# Altium project EDISON_ARDUINO_HVM_8_26_OLD.PrjPcb (part 1 of 2)
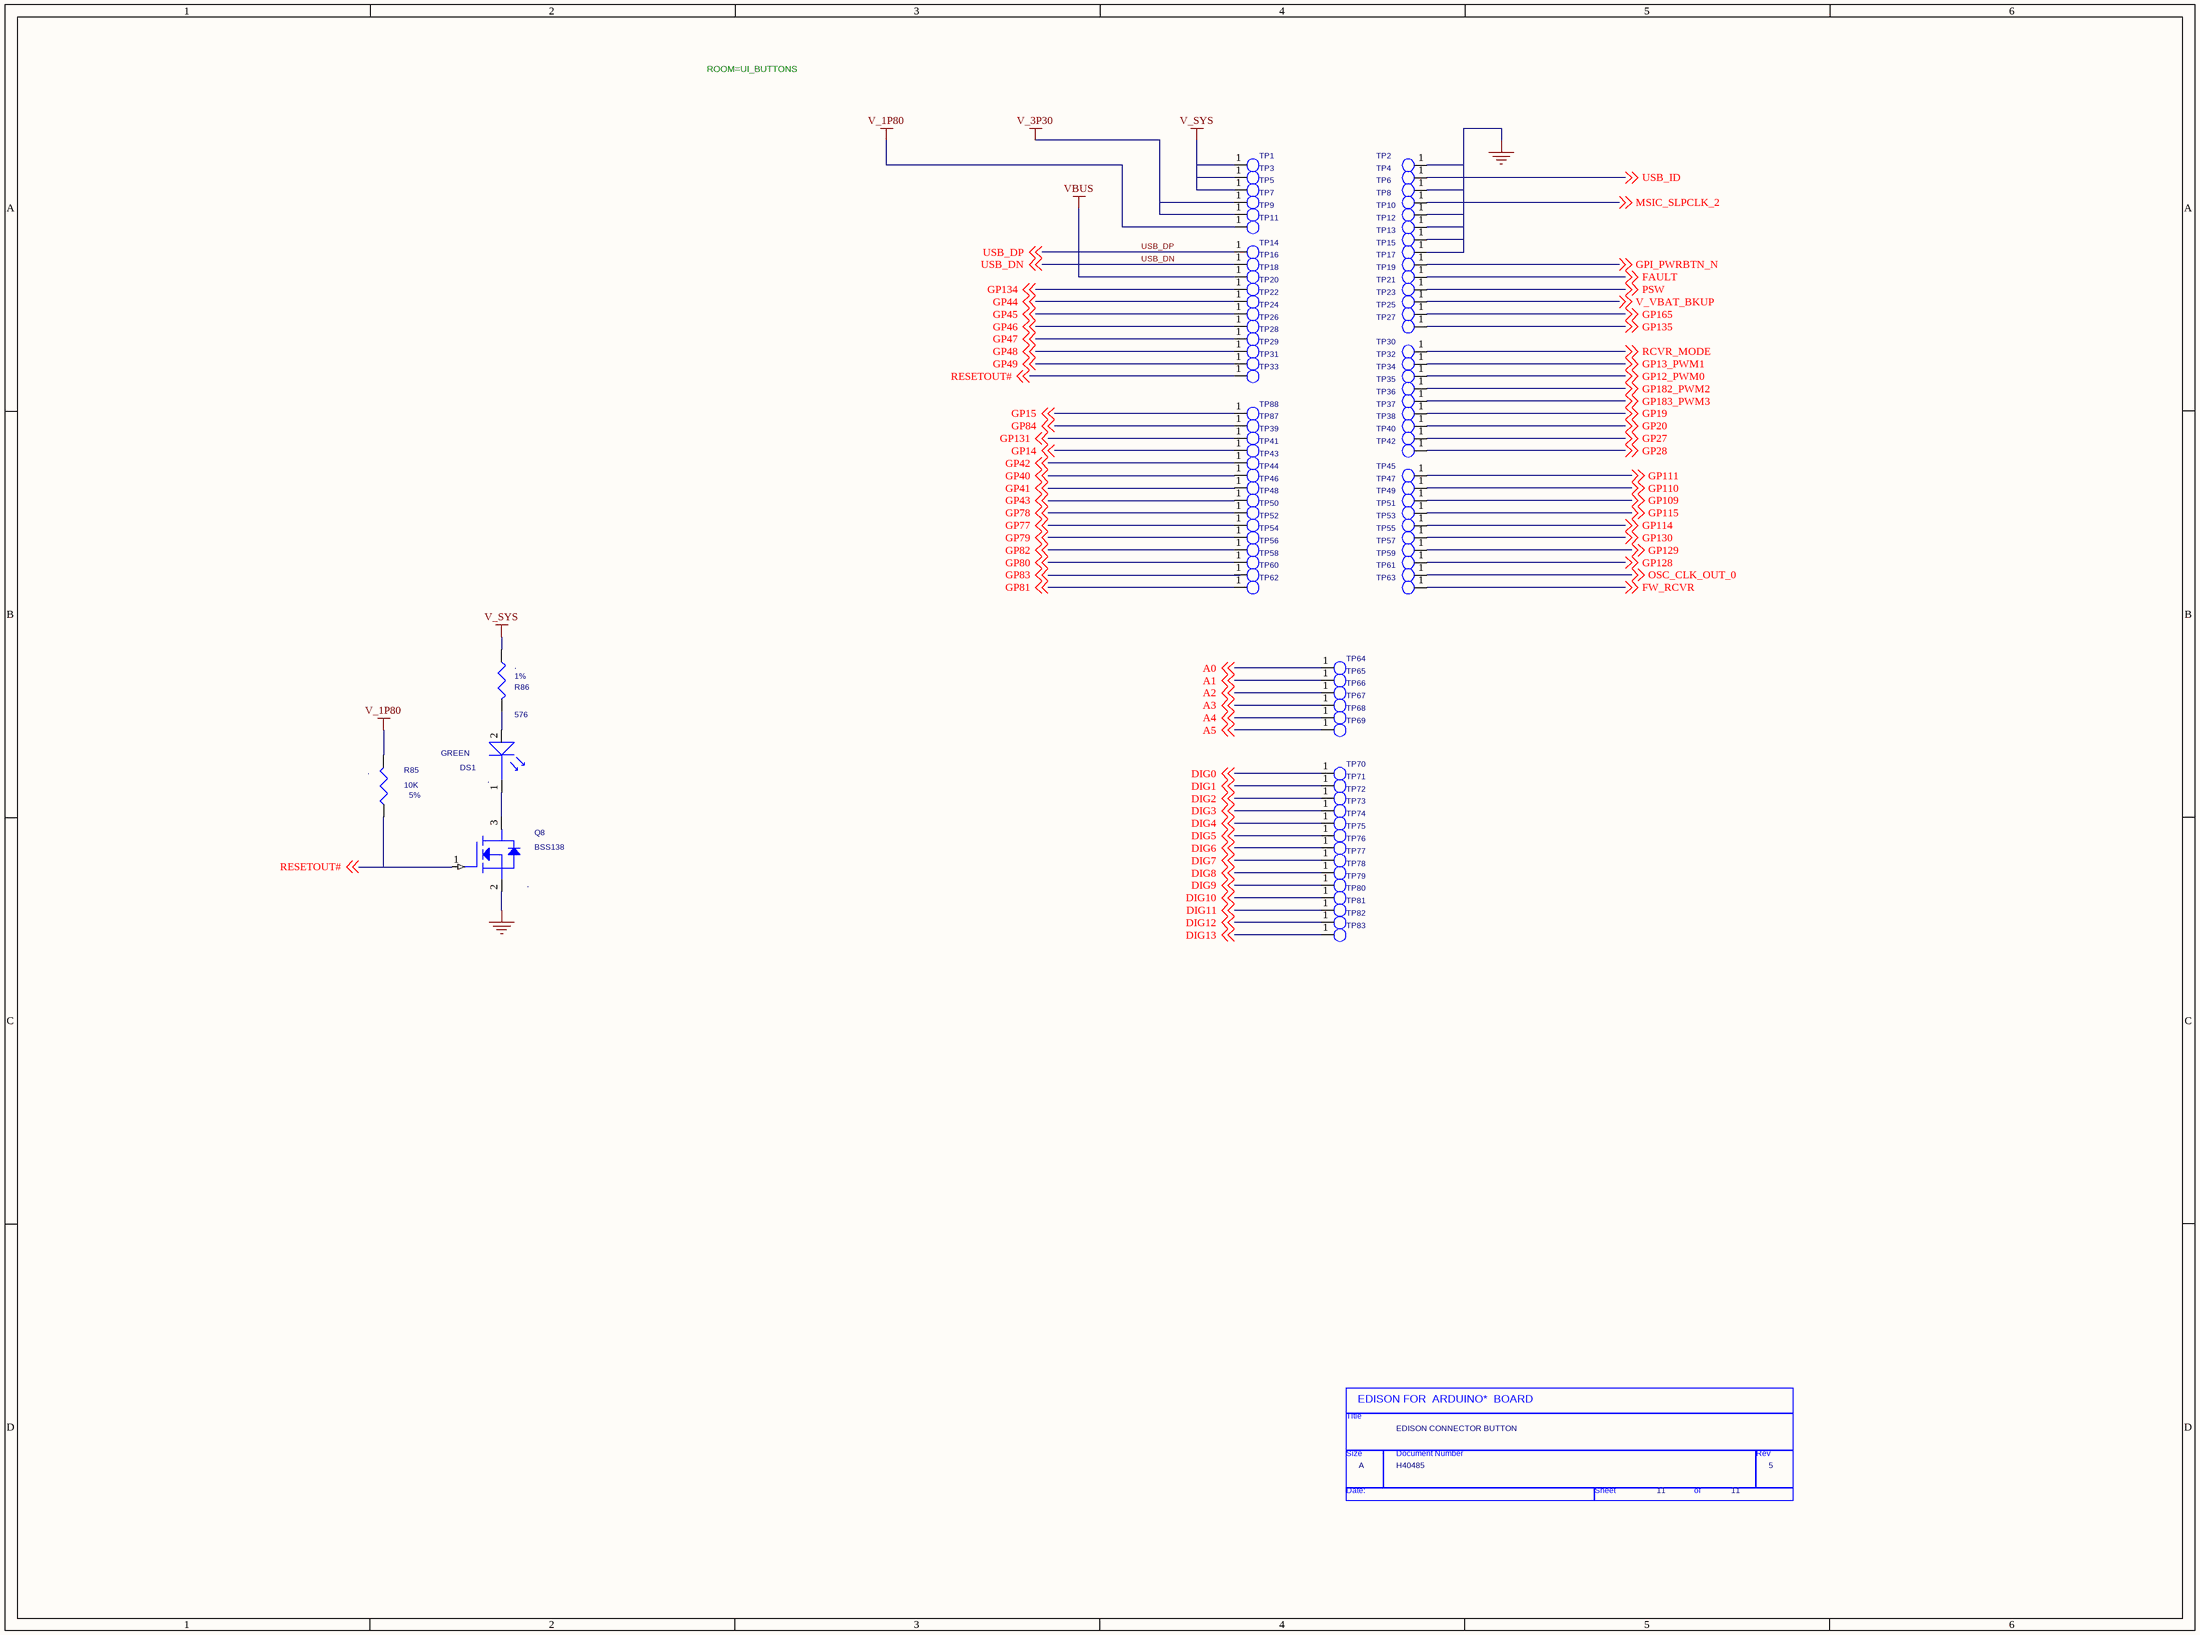
[diagram p0: 11) TEST POINTS.SchDoc]
11 sheets, 378 parts. Net scope: global (net labels, ports and power ports of the same name join across sheets).
Sheets:
  11) TEST POINTS.SchDoc
  10) Button and I_O Conn.SchDoc
  09) USB.SchDoc
  08) SD card.SchDoc
  07) DIGITAL TRANSLATION.SchDoc
  06) ANALOG TRANSLATION.SchDoc
  05) SPI ADC AND SWIZZLE.SchDoc
  04) UART to USB debug p.SchDoc
  01) Title Page.SchDoc
  03) POWER SUPPLIES.SchDoc
  02) Table of Contents.SchDoc

## Sheet 11) TEST POINTS.SchDoc
size 447 x 332 mm

### Parts
(Parts that share a designator on the sheet are numbered #1, #2 ... from top to bottom, then left to right.)
*#1  Page Count: 11  Page Size: A  Title: EDISON CONNECTOR BUTTON  RevCode: 5  Doc: H40485  (hidden comment: TitleBlock0)  (graphical)
DS1  GREEN  NO_STUFF: .  [smled0402]
Q8  BSS138  NO_STUFF: .  [SOT23]
R85  10K  NO_STUFF: .  TOL: 5%  [SMR0201]
R86  576  NO_STUFF: .  TOL: 1%  [SMR0201]
TP1  30 MIL TESTPAD  [TESTPAD_C80]  (value not drawn)
TP2  30 MIL TESTPAD  [TESTPAD_C80]  (value not drawn)
TP3  30 MIL TESTPAD  [TESTPAD_C80]  (value not drawn)
TP4  30 MIL TESTPAD  [TESTPAD_C80]  (value not drawn)
TP5  30 MIL TESTPAD  [TESTPAD_C80]  (value not drawn)
TP6  30 MIL TESTPAD  [TESTPAD_C80]  (value not drawn)
TP7  30 MIL TESTPAD  [TESTPAD_C80]  (value not drawn)
TP8  30 MIL TESTPAD  [TESTPAD_C80]  (value not drawn)
TP9  30 MIL TESTPAD  [TESTPAD_C80]  (value not drawn)
TP10  30 MIL TESTPAD  [TESTPAD_C80]  (value not drawn)
TP11  30 MIL TESTPAD  [TESTPAD_C80]  (value not drawn)
TP12  30 MIL TESTPAD  [TESTPAD_C80]  (value not drawn)
TP13  30 MIL TESTPAD  [TESTPAD_C80]  (value not drawn)
TP14  30 MIL TESTPAD  [TESTPAD_C80]  (value not drawn)
TP15  30 MIL TESTPAD  [TESTPAD_C80]  (value not drawn)
TP16  30 MIL TESTPAD  [TESTPAD_C80]  (value not drawn)
TP17  30 MIL TESTPAD  [TESTPAD_C80]  (value not drawn)
TP18  30 MIL TESTPAD  [TESTPAD_C80]  (value not drawn)
TP19  30 MIL TESTPAD  [TESTPAD_C80]  (value not drawn)
TP20  30 MIL TESTPAD  [TESTPAD_C80]  (value not drawn)
TP21  30 MIL TESTPAD  [TESTPAD_C80]  (value not drawn)
TP22  30 MIL TESTPAD  [TESTPAD_C80]  (value not drawn)
TP23  30 MIL TESTPAD  [TESTPAD_C80]  (value not drawn)
TP24  30 MIL TESTPAD  [TESTPAD_C80]  (value not drawn)
TP25  30 MIL TESTPAD  [TESTPAD_C80]  (value not drawn)
TP26  30 MIL TESTPAD  [TESTPAD_C80]  (value not drawn)
TP27  30 MIL TESTPAD  [TESTPAD_C80]  (value not drawn)
TP28  30 MIL TESTPAD  [TESTPAD_C80]  (value not drawn)
TP29  30 MIL TESTPAD  [TESTPAD_C80]  (value not drawn)
TP30  30 MIL TESTPAD  [TESTPAD_C80]  (value not drawn)
TP31  30 MIL TESTPAD  [TESTPAD_C80]  (value not drawn)
TP32  30 MIL TESTPAD  [TESTPAD_C80]  (value not drawn)
TP33  30 MIL TESTPAD  [TESTPAD_C80]  (value not drawn)
TP34  30 MIL TESTPAD  [TESTPAD_C80]  (value not drawn)
TP35  30 MIL TESTPAD  [TESTPAD_C80]  (value not drawn)
TP36  30 MIL TESTPAD  [TESTPAD_C80]  (value not drawn)
TP37  30 MIL TESTPAD  [TESTPAD_C80]  (value not drawn)
TP38  30 MIL TESTPAD  [TESTPAD_C80]  (value not drawn)
TP39  30 MIL TESTPAD  [TESTPAD_C80]  (value not drawn)
TP40  30 MIL TESTPAD  [TESTPAD_C80]  (value not drawn)
TP41  30 MIL TESTPAD  [TESTPAD_C80]  (value not drawn)
TP42  30 MIL TESTPAD  [TESTPAD_C80]  (value not drawn)
TP43  30 MIL TESTPAD  [TESTPAD_C80]  (value not drawn)
TP44  30 MIL TESTPAD  [TESTPAD_C80]  (value not drawn)
TP45  30 MIL TESTPAD  [TESTPAD_C80]  (value not drawn)
TP46  30 MIL TESTPAD  [TESTPAD_C80]  (value not drawn)
TP47  30 MIL TESTPAD  [TESTPAD_C80]  (value not drawn)
TP48  30 MIL TESTPAD  [TESTPAD_C80]  (value not drawn)
TP49  30 MIL TESTPAD  [TESTPAD_C80]  (value not drawn)
TP50  30 MIL TESTPAD  [TESTPAD_C80]  (value not drawn)
TP51  30 MIL TESTPAD  [TESTPAD_C80]  (value not drawn)
TP52  30 MIL TESTPAD  [TESTPAD_C80]  (value not drawn)
TP53  30 MIL TESTPAD  [TESTPAD_C80]  (value not drawn)
TP54  30 MIL TESTPAD  [TESTPAD_C80]  (value not drawn)
TP55  30 MIL TESTPAD  [TESTPAD_C80]  (value not drawn)
TP56  30 MIL TESTPAD  [TESTPAD_C80]  (value not drawn)
TP57  30 MIL TESTPAD  [TESTPAD_C80]  (value not drawn)
TP58  30 MIL TESTPAD  [TESTPAD_C80]  (value not drawn)
TP59  30 MIL TESTPAD  [TESTPAD_C80]  (value not drawn)
TP60  30 MIL TESTPAD  [TESTPAD_C80]  (value not drawn)
TP61  30 MIL TESTPAD  [TESTPAD_C80]  (value not drawn)
TP62  30 MIL TESTPAD  [TESTPAD_C80]  (value not drawn)
TP63  30 MIL TESTPAD  [TESTPAD_C80]  (value not drawn)
TP64  30 MIL TESTPAD  [TESTPAD_C80]  (value not drawn)
TP65  30 MIL TESTPAD  [TESTPAD_C80]  (value not drawn)
TP66  30 MIL TESTPAD  [TESTPAD_C80]  (value not drawn)
TP67  30 MIL TESTPAD  [TESTPAD_C80]  (value not drawn)
TP68  30 MIL TESTPAD  [TESTPAD_C80]  (value not drawn)
TP69  30 MIL TESTPAD  [TESTPAD_C80]  (value not drawn)
TP70  30 MIL TESTPAD  [TESTPAD_C80]  (value not drawn)
TP71  30 MIL TESTPAD  [TESTPAD_C80]  (value not drawn)
TP72  30 MIL TESTPAD  [TESTPAD_C80]  (value not drawn)
TP73  30 MIL TESTPAD  [TESTPAD_C80]  (value not drawn)
TP74  30 MIL TESTPAD  [TESTPAD_C80]  (value not drawn)
TP75  30 MIL TESTPAD  [TESTPAD_C80]  (value not drawn)
TP76  30 MIL TESTPAD  [TESTPAD_C80]  (value not drawn)
TP77  30 MIL TESTPAD  [TESTPAD_C80]  (value not drawn)
TP78  30 MIL TESTPAD  [TESTPAD_C80]  (value not drawn)
TP79  30 MIL TESTPAD  [TESTPAD_C80]  (value not drawn)
TP80  30 MIL TESTPAD  [TESTPAD_C80]  (value not drawn)
TP81  30 MIL TESTPAD  [TESTPAD_C80]  (value not drawn)
TP82  30 MIL TESTPAD  [TESTPAD_C80]  (value not drawn)
TP83  30 MIL TESTPAD  [TESTPAD_C80]  (value not drawn)
TP87  30 MIL TESTPAD  [TESTPAD_C80]  (value not drawn)
TP88  30 MIL TESTPAD  [TESTPAD_C80]  (value not drawn)

### Nets
GND: Q8.2(S) TP2.1 TP6.1 TP10.1 TP12.1 TP13.1 TP15.1  [project net PWRBTN_GND]
V_1P80: R85.2 TP11.1
V_3P30: TP7.1 TP9.1
V_SYS: R86.2 TP1.1 TP3.1 TP5.1
VBUS: TP18.1
A0: TP64.1 ; off-sheet A0
A1: TP65.1 ; off-sheet A1
A2: TP66.1 ; off-sheet A2
A3: TP67.1 ; off-sheet A3
A4: TP68.1 ; off-sheet A4
A5: TP69.1 ; off-sheet A5
DIG0: TP70.1 ; off-sheet DIG0
DIG1: TP71.1 ; off-sheet DIG1
DIG2: TP72.1 ; off-sheet DIG2
DIG3: TP73.1 ; off-sheet DIG3
DIG4: TP74.1 ; off-sheet DIG4
DIG5: TP75.1 ; off-sheet DIG5
DIG6: TP76.1 ; off-sheet DIG6
DIG7: TP77.1 ; off-sheet DIG7
DIG8: TP78.1 ; off-sheet DIG8
DIG9: TP79.1 ; off-sheet DIG9
DIG10: TP80.1 ; off-sheet DIG10
DIG11: TP81.1 ; off-sheet DIG11
DIG12: TP82.1 ; off-sheet DIG12
DIG13: TP83.1 ; off-sheet DIG13
FAULT: TP19.1 ; off-sheet FAULT
FW_RCVR: TP63.1 ; off-sheet FW_RCVR
GP12_PWM0: TP34.1 ; off-sheet GP12_PWM0
GP13_PWM1: TP32.1 ; off-sheet GP13_PWM1
GP14: TP41.1 ; off-sheet GP14
GP15: TP88.1 ; off-sheet GP15
GP19: TP37.1 ; off-sheet GP19
GP20: TP38.1 ; off-sheet GP20
GP27: TP40.1 ; off-sheet GP27
GP28: TP42.1 ; off-sheet GP28
GP40: TP44.1 ; off-sheet GP40
GP41: TP46.1 ; off-sheet GP41
GP42: TP43.1 ; off-sheet GP42
GP43: TP48.1 ; off-sheet GP43
GP44: TP22.1 ; off-sheet GP44
GP45: TP24.1 ; off-sheet GP45
GP46: TP26.1 ; off-sheet GP46
GP47: TP28.1 ; off-sheet GP47
GP48: TP29.1 ; off-sheet GP48
GP49: TP31.1 ; off-sheet GP49
GP77: TP52.1 ; off-sheet GP77
GP78: TP50.1 ; off-sheet GP78
GP79: TP54.1 ; off-sheet GP79
GP80: TP58.1 ; off-sheet GP80
GP81: TP62.1 ; off-sheet GP81
GP82: TP56.1 ; off-sheet GP82
GP83: TP60.1 ; off-sheet GP83
GP84: TP87.1 ; off-sheet GP84
GP109: TP49.1 ; off-sheet GP109
GP110: TP47.1 ; off-sheet GP110
GP111: TP45.1 ; off-sheet GP111
GP114: TP53.1 ; off-sheet GP114
GP115: TP51.1 ; off-sheet GP115
GP128: TP59.1 ; off-sheet GP128
GP129: TP57.1 ; off-sheet GP129
GP130: TP55.1 ; off-sheet GP130
GP131: TP39.1 ; off-sheet GP131
GP134: TP20.1 ; off-sheet GP134
GP135: TP27.1 ; off-sheet GP135
GP165: TP25.1 ; off-sheet GP165
GP182_PWM2: TP35.1 ; off-sheet GP182_PWM2
GP183_PWM3: TP36.1 ; off-sheet GP183_PWM3
GPI_PWRBTN_N: TP17.1 ; off-sheet GPI_PWRBTN_N
MSIC_SLPCLK_2: TP8.1 ; off-sheet MSIC_SLPCLK_2
OSC_CLK_OUT_0: TP61.1 ; off-sheet OSC_CLK_OUT_0
PSW: TP21.1 ; off-sheet PSW
RCVR_MODE: TP30.1 ; off-sheet RCVR_MODE
RESETOUT#: Q8.1(G) R85.1 TP33.1 ; off-sheet RESETOUT#
USB_DN: TP16.1 ; off-sheet USB_DN
USB_DP: TP14.1 ; off-sheet USB_DP
USB_ID: TP4.1 ; off-sheet USB_ID
V_VBAT_BKUP: TP23.1 ; off-sheet V_VBAT_BKUP
NetDS1_1: DS1.1(LED1) Q8.3(D)
NetDS1_2: DS1.2(LED2) R86.1

### Notes on the sheet
- ROOM=UI_BUTTONS
- (in symbol TitleBlock0) EDISON FOR  ARDUINO*  BOARD; Title; Size; Document Number; Rev; Date:; Sheet; of

### Library data of the parts
DS1 = LED,SMT,GREEN,V,0402: LED,1005,SM,GRN,V,1.00,RC,1; Device: E54986-003; LEAD_FREE: YES; BOM: x; IPN: E54986-003; PART_NUMBER: E54986-003; FINANCE: x
Q8 = XSTR,BSS138,FET,NCH,SOT23: IC,DS,FET N,SOT-23,BSS138LT3G; FINANCE: x; LEAD_FREE: YES; Device: C81974-001; BOM: x; IPN: C81974-001; PART_NUMBER: C81974-001
R85 = RESD,0201,5%,1/20W,10K: RES D,0201,10.00 kOHM,5.00%,1/20W,YES; Device: C80792-002; BOM: x; ROOM: AUDIO_CODEC; RATING: 1/20W; IPN: C80792-002; PART_NUMBER: C80792-002; LEAD_FREE: YES; FINANCE: x
R86 = RESD,0201,1%,1/20W,562: RES D,0402,576.00 OHM,1.00%,1/16W,YES; PART_NUMBER: A93548-403; RATING: 1/20W; BOM: x; LEAD_FREE: YES; FINANCE: x
TP1-TP83 TP87 TP88 = TestPad,C80,SMT: LEAD_FREE: NO; FINANCE: x; IPN: TESTPAD_80; DEVICE: TESTPAD_30; ROOM: TEST_APE; BOM: x; PART_NUMBER: TESTPAD_30; NO_STUFF: NO_STUFF
*#1 = TitleBlock0: Page Number: 11; Page Create Date: March  8, 1995

## Sheet 10) Button and I_O Conn.SchDoc
size 447 x 332 mm
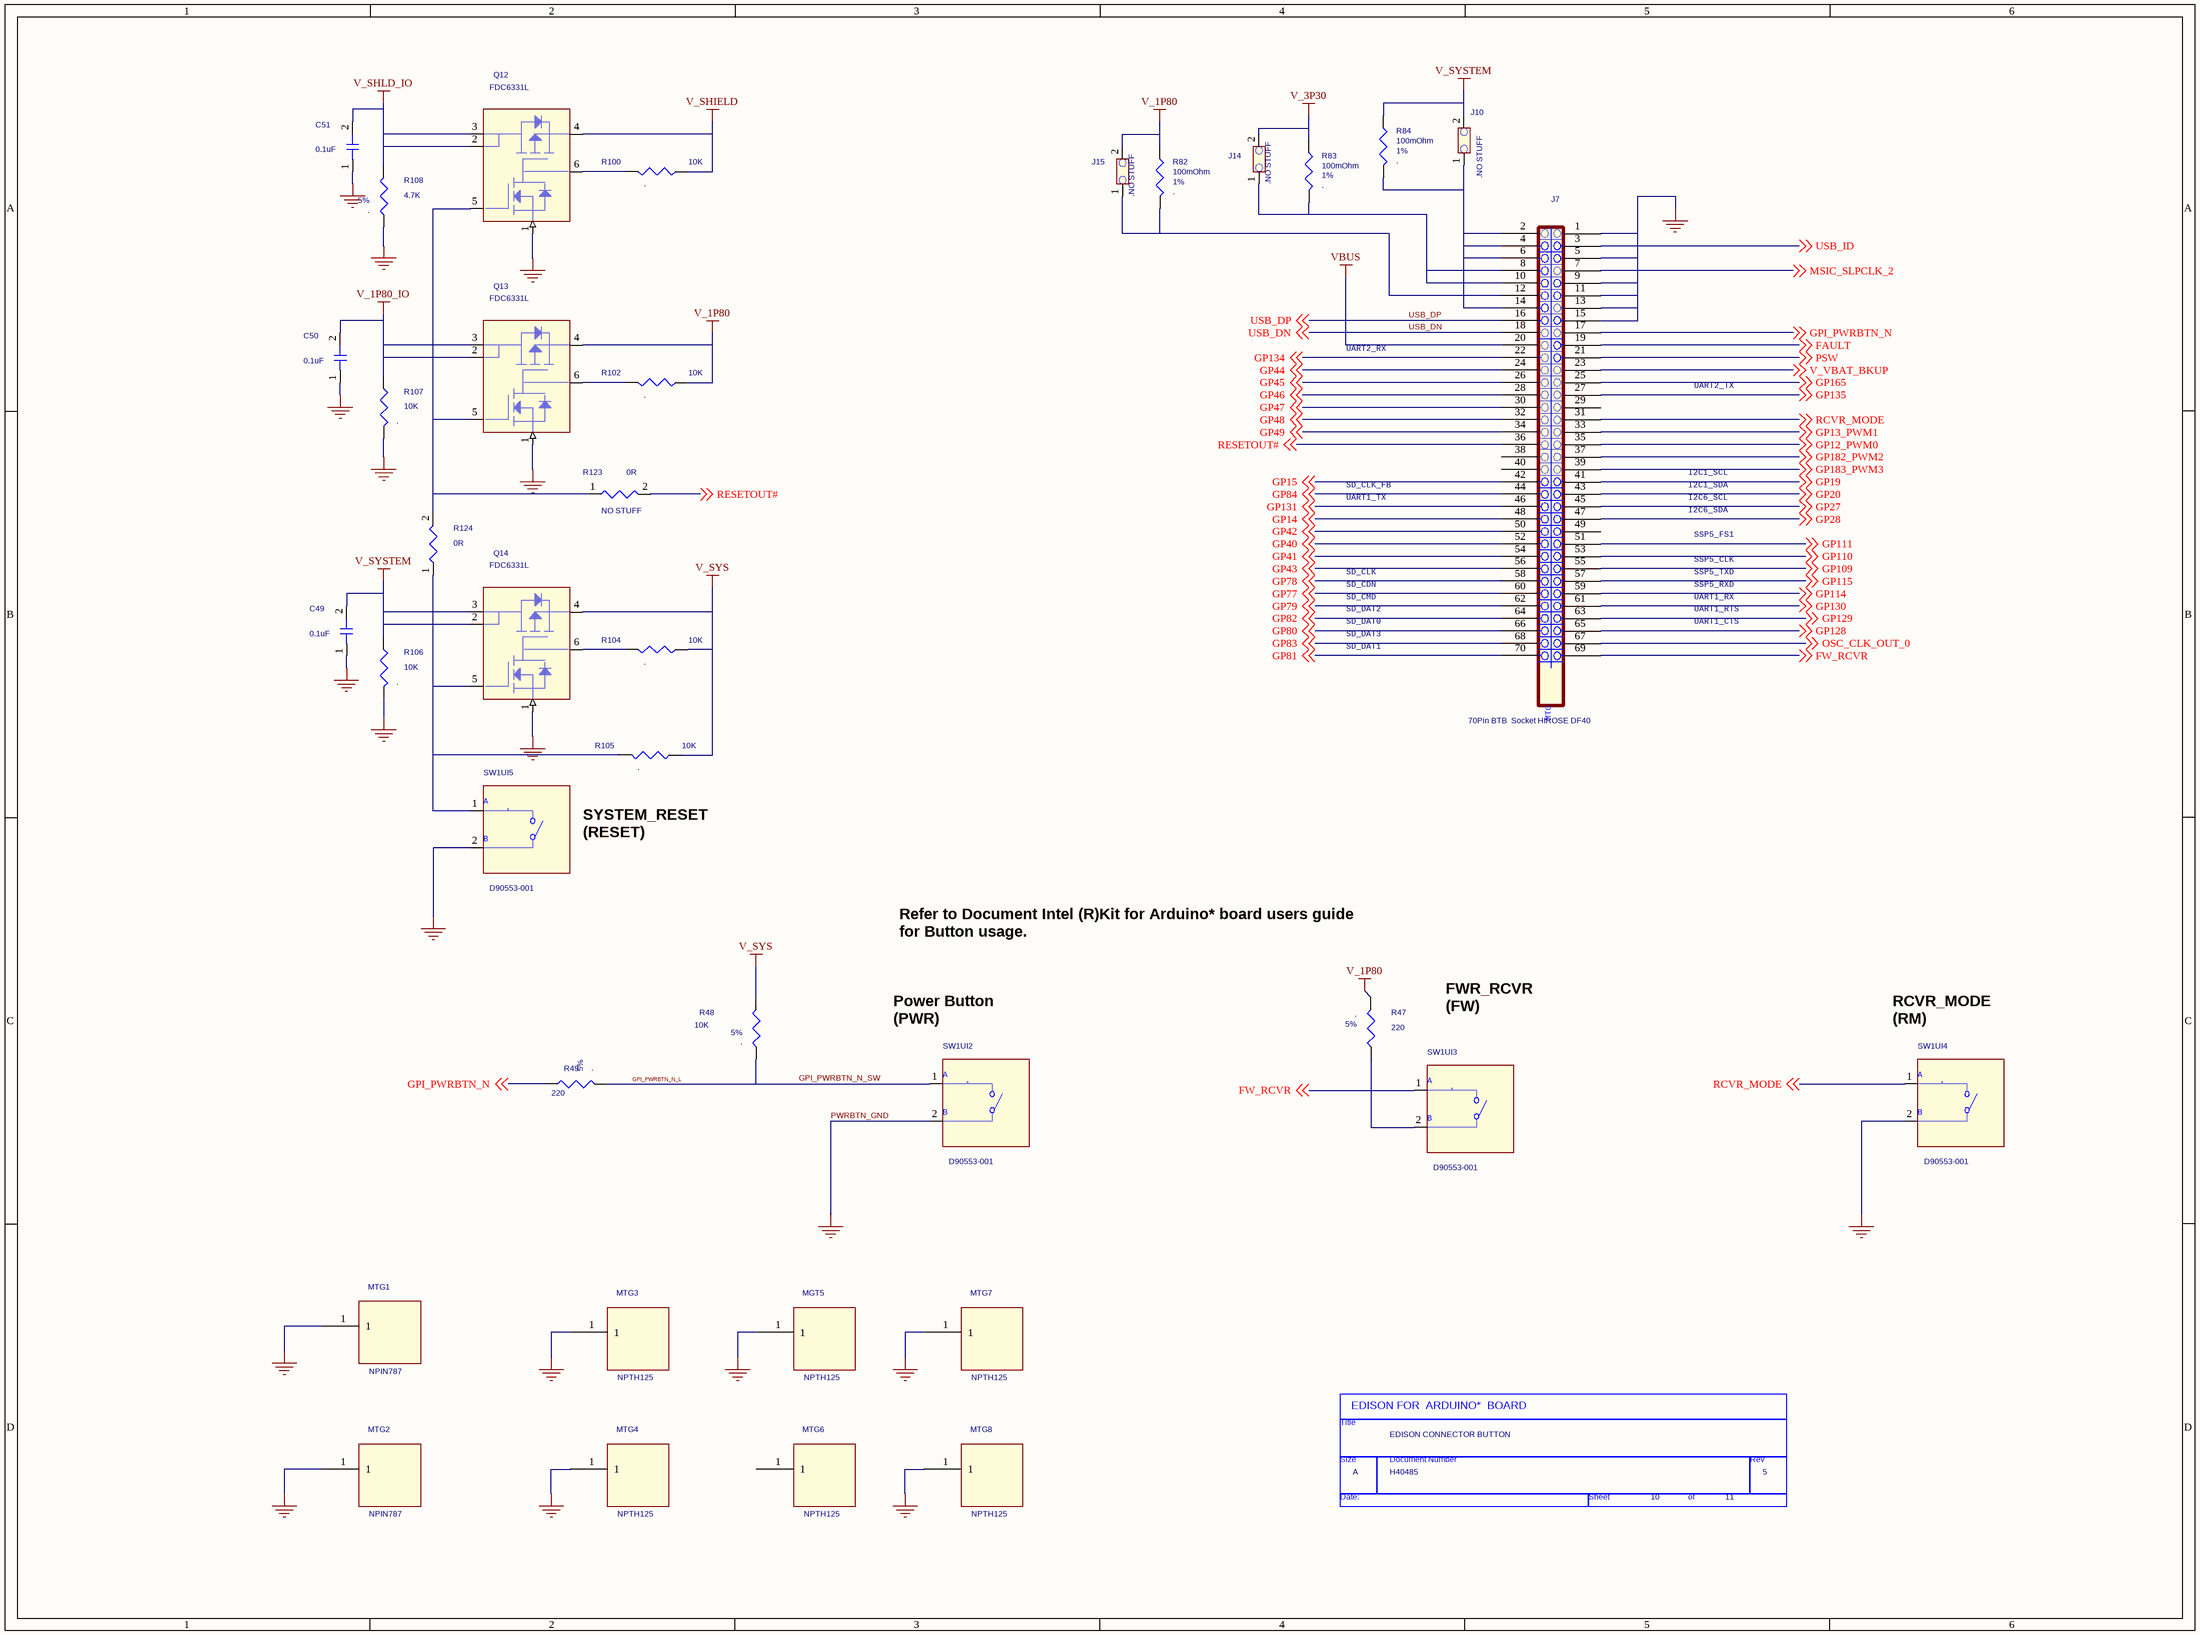
[diagram p1: 10) Button and I_O Conn.SchDoc]

### Parts
(Parts that share a designator on the sheet are numbered #1, #2 ... from top to bottom, then left to right.)
*#2  Page Count: 11  Page Number: 10  Page Size: A  Title: EDISON CONNECTOR BUTTON  RevCode: 5  Doc: H40485  (hidden comment: TitleBlock0)  (graphical)
C49  0.1uF  [C0201]
C50  0.1uF  [C0201]
C51  0.1uF  [C0201]
J7  70Pin BTB  Socket HIROSE DF40  [2x35_p4mm_btb_axt_skt]
J10  NO_STUFF: .NO STUFF  [102276-001]  (hidden comment: CON2_HDR)
J14  NO_STUFF: .NO STUFF  [102276-001]  (hidden comment: CON2_HDR)
J15  NO_STUFF: .NO STUFF  [102276-001]  (hidden comment: CON2_HDR)
MGT5  NPTH125  [SYMBOL_NPTH125]
MTG1  NPIN787  [NPIN787]
MTG2  NPIN787  [NPIN787]
MTG3  NPTH125  [SYMBOL_NPTH125]
MTG4  NPTH125  [SYMBOL_NPTH125]
MTG6  NPTH125  [SYMBOL_NPTH125]
MTG7  NPTH125  [SYMBOL_NPTH125]
MTG8  NPTH125  [SYMBOL_NPTH125]
Q12  FDC6331L  [SSOT-6]
Q13  FDC6331L  [SSOT-6]
Q14  FDC6331L  [SSOT-6]
R47  220  NO_STUFF: .  TOL: 5%  [SMR0201]
R48  10K  NO_STUFF: .  TOL: 5%  [SMR0201]
R49  220  NO_STUFF: .  TOL: 5%  [SMR0201]
R82  100mOhm  TOL: 1%  NO_STUFF: .  [SMR0402]
R83  100mOhm  TOL: 1%  NO_STUFF: .  [SMR0402]
R84  100mOhm  TOL: 1%  NO_STUFF: .  [SMR0402]
R100  10K  NO_STUFF: .  [SMR0201]
R102  10K  NO_STUFF: .  [SMR0201]
R104  10K  NO_STUFF: .  [SMR0201]
R105  10K  NO_STUFF: .  [SMR0201]
R106  10K  NO_STUFF: .  [SMR0201]
R107  10K  NO_STUFF: .  [SMR0201]
R108  4.7K  NO_STUFF: .  TOL: 5%  [SMR0201]
R123  0R  [0603.PRT]
R124  0R  [0603.PRT]
SW1UI2  PART_NUMBER: D90553-001  [sw_evqp7_4p]  (hidden comment: LIGHT TOUCH SWITCH EVQP7J01P)
SW1UI3  PART_NUMBER: D90553-001  [sw_evqp7_4p]  (hidden comment: LIGHT TOUCH SWITCH EVQP7J01P)
SW1UI4  PART_NUMBER: D90553-001  [sw_evqp7_4p]  (hidden comment: LIGHT TOUCH SWITCH EVQP7J01P)
SW1UI5  PART_NUMBER: D90553-001  [sw_evqp7_4p]  (hidden comment: LIGHT TOUCH SWITCH EVQP7J01P)

### Nets
PWRBTN_GND: C49.1(END1) C50.1(END1) C51.1(END1) J7.1 J7.5 J7.9 J7.11 J7.13 J7.15 MGT5.1 MTG1.1 MTG2.1 MTG3.1 MTG4.1 MTG7.1 MTG8.1 Q12.1(R2) Q13.1(R2) Q14.1(R2) R106.2 R107.2 R108.2 SW1UI2.2(B) SW1UI4.2(B) SW1UI5.2(B)  [also labelled GND]
V_1P80: J15.2 Q13.4(VOUT) R47.2 R82.1 R102.1
V_1P80_IO: C50.2(END2) Q13.2(VOUT2) Q13.3(VOUT1) R107.1
V_3P30: J14.2 R83.1
V_SHIELD: Q12.4(VOUT) R100.1
V_SHLD_IO: C51.2(END2) Q12.2(VOUT2) Q12.3(VOUT1) R108.1
V_SYS: Q14.4(VOUT) R48.1 R104.1 R105.1
V_SYSTEM: C49.2(END2) J10.2 Q14.2(VOUT2) Q14.3(VOUT1) R84.1 R106.1
VBUS: J7.20
FAULT: J7.19 ; off-sheet FAULT
FW_RCVR: J7.69 SW1UI3.1(A) ; off-sheet FW_RCVR
GP12_PWM0: J7.35 ; off-sheet GP12_PWM0
GP13_PWM1: J7.33 ; off-sheet GP13_PWM1
GP14: J7.48 ; off-sheet GP14
GP15: J7.42 ; off-sheet GP15
GP19: J7.41 ; off-sheet GP19
GP20: J7.43 ; off-sheet GP20
GP27: J7.45 ; off-sheet GP27
GP28: J7.47 ; off-sheet GP28
GP40: J7.52 ; off-sheet GP40
GP41: J7.54 ; off-sheet GP41
GP42: J7.50 ; off-sheet GP42
GP43: J7.56 ; off-sheet GP43
GP44: J7.24 ; off-sheet GP44
GP45: J7.26 ; off-sheet GP45
GP46: J7.28 ; off-sheet GP46
GP47: J7.30 ; off-sheet GP47
GP48: J7.32 ; off-sheet GP48
GP49: J7.34 ; off-sheet GP49
GP77: J7.60 ; off-sheet GP77
GP78: J7.58 ; off-sheet GP78
GP79: J7.62 ; off-sheet GP79
GP80: J7.66 ; off-sheet GP80
GP81: J7.70 ; off-sheet GP81
GP82: J7.64 ; off-sheet GP82
GP83: J7.68 ; off-sheet GP83
GP84: J7.44 ; off-sheet GP84
GP109: J7.55 ; off-sheet GP109
GP110: J7.53 ; off-sheet GP110
GP111: J7.51 ; off-sheet GP111
GP114: J7.59 ; off-sheet GP114
GP115: J7.57 ; off-sheet GP115
GP128: J7.65 ; off-sheet GP128
GP129: J7.63 ; off-sheet GP129
GP130: J7.61 ; off-sheet GP130
GP131: J7.46 ; off-sheet GP131
GP134: J7.22 ; off-sheet GP134
GP135: J7.27 ; off-sheet GP135
GP165: J7.25 ; off-sheet GP165
GP182_PWM2: J7.37 ; off-sheet GP182_PWM2
GP183_PWM3: J7.39 ; off-sheet GP183_PWM3
GPI_PWRBTN_N: J7.17 R49.1 ; off-sheet GPI_PWRBTN_N
GPI_PWRBTN_N_L: R48.2 R49.2 SW1UI2.1(A)  [also labelled GPI_PWRBTN_N_SW]
MSIC_SLPCLK_2: J7.7 ; off-sheet MSIC_SLPCLK_2
OSC_CLK_OUT_0: J7.67 ; off-sheet OSC_CLK_OUT_0
PSW: J7.21 ; off-sheet PSW
RCVR_MODE: J7.31 SW1UI4.1(A) ; off-sheet RCVR_MODE
RESETOUT#: J7.36 R123.2 ; off-sheet RESETOUT#
USB_DN: J7.18 ; off-sheet USB_DN
USB_DP: J7.16 ; off-sheet USB_DP
USB_ID: J7.3 ; off-sheet USB_ID
V_VBAT_BKUP: J7.23 ; off-sheet V_VBAT_BKUP
NetJ7_2: J7.2 J7.4 J7.6 J7.14 J10.1 R84.2
NetJ7_8: J7.8 J7.10 J14.1 R83.2
NetJ7_12: J7.12 J15.1 R82.2
NetQ12_5: Q12.5(ON) Q13.5(ON) R123.1 R124.2
NetQ12_6: Q12.6(R1C1) R100.2
NetQ13_6: Q13.6(R1C1) R102.2
NetQ14_5: Q14.5(ON) R105.2 R124.1 SW1UI5.1(A)
NetQ14_6: Q14.6(R1C1) R104.2
NetR47_1: R47.1 SW1UI3.2(B)

Not connected (* = marked no-connect by the designer): J7 29 38 40 49; MTG6 1

### Notes on the sheet
- UART2_RX
- UART2_TX
- I2C1_SCL
- UART1_TX
- SD_CLK_FB
- I2C1_SDA
- I2C6_SCL
- I2C6_SDA
- SSP5_FS1
- SD_CLK
- SD_CDN
- SD_CMD
- SSP5_CLK
- SSP5_TXD
- SSP5_RXD
- UART1_RX
- SD_DAT2
- SD_DAT0
- SD_DAT3
- SD_DAT1
- UART1_RTS
- UART1_CTS
- SYSTEM_RESET
  (RESET)
- Refer to Document Intel (R)Kit for Arduino* board users guide
  for Button usage.
- (near SW1UI2) Power Button
  (PWR)
- FWR_RCVR
  (FW)
- (near SW1UI4) RCVR_MODE
  (RM)
- (in symbol CON70,SKT,SM,4mm,AXT570124_0) MTG
- (in symbol TitleBlock0) EDISON FOR  ARDUINO*  BOARD; Title; Size; Document Number; Rev; Date:; Sheet; of

### Library data of the parts
C49-C51 = CAP: CAPC,X5R,0201,0.1UF,10.00V,+/- 10%; PART_NUMBER: C83410-014; Manufacturer: GENERIC; OriginalSymbolOrigin: (-50,50); Process: SMD; Code: 27; VOLTAGE: ?; PERC: ?; PATH: ?
J7 = CON70,SKT,SM,4mm,AXT570124_0: CONN,MISC,70P,BTB SKT,.4MM SMT; PART_NUMBER: H42241-001; ROOM: NO_ROOM; NO_STUFF: .; FINANCE: x; LEAD_FREE: YES; MFG: HIROSE; BOM: x; IPN: H42241-001; DEVICE: H42241-001
J10 J14 J15 = CON2,HDR,TH,0.1in,A91829-020: CONN,HDR,1 X 2,PLG,VT,0.1,093ST,KP; PART_NUMBER: E81838-001; LEAD_FREE: YES; Device: E81838-001; IPN: E81838-001; BOM: x; FINANCE: x
MGT5 MTG3 MTG4 MTG6-MTG8 = symbol_npth125_0
MTG1 MTG2 = MOUNTING HOLE 787
Q12-Q14 = IC,FDC6331,LOADSWI: C,FDC6331L,LOAD_SWITCH,2.8A; PART_NUMBER: G79283-001; NO_STUFF: .; LEAD_FREE: YES; BOM: x; IPN: G79283-001; Device: fdc6331; FINANCE: x; PART NUMBER: G79283-001
R47 R49 = RESD,0201,5%,1/20W,220: RES_D,0201,220.00OHM,5.00%,1/20W,; Device: C80792-046; LEAD_FREE: YES; BOM: x; ROOM: UI_BUTTONS; RATING: 1/20W; IPN: C80792-046; PART_NUMBER: C80792-046; FINANCE: x
R48 = RESD,0201,5%,1/20W,10K: RES D,0201,10.00 kOHM,5.00%,1/20W,YES; Device: C80792-002; BOM: x; ROOM: USB; RATING: 1/20W; IPN: C80792-002; PART_NUMBER: C80792-002; LEAD_FREE: YES; FINANCE: x
R82-R84 = RESD,0402,1%,1/16W,100mOhm: RES D,0402,0.10 OHM,1.00%,,1/16W; PART_NUMBER: C65288-008; LEAD_FREE: YES; BOM: x; IPN: C65288-008; RATING: 1/16W; Device: C65288-008; FINANCE: x
R100 R102 R104-R107 = RESD,0201,5%,1/20W,10K: RES D,0201,10.00 kOHM,5.00%,1/20W,YES; Device: C80792-002; TOL: 5%; BOM: x; ROOM: AUDIO_CODEC; RATING: 1/20W; IPN: C80792-002; PART_NUMBER: C80792-002; LEAD_FREE: YES; FINANCE: x
R108 = RESD,0201,5%,1/20W,4.7K: RES D,0201,4.70 kOHM,5.00%,1/20W,YES; Device: C80792-014; BOM: x; ROOM: APE_PMIC_MISC; RATING: 1/20W; IPN: C80792-014; PART_NUMBER: C80792-014; LEAD_FREE: YES; FINANCE: x
R123 R124 = R_0: RES_D,0201,0.00OHM,1/20W; Manufacturer: Yageo; PART_NUMBER: C80792-009
  R123: NO STUFF: NO STUFF
SW1UI2-SW1UI5 = SWITCH,EVQP7J01P,4P,PWR_0: CONN,SWIT,TACTILE,VT,SPST,2,50.0 mA,SMT>; MFG: Panasonic; BOM: x; ROOM: UI_BUTTONS; NO_STUFF: .; LEAD_FREE: YES; MFG P/N: EVQP7J01P; IPN: D90553-001; FINANCE: x; DEVICE: D90553-001
*#2 = TitleBlock0: Page Create Date: March  8, 1995

## Sheet 09) USB.SchDoc
size 447 x 332 mm
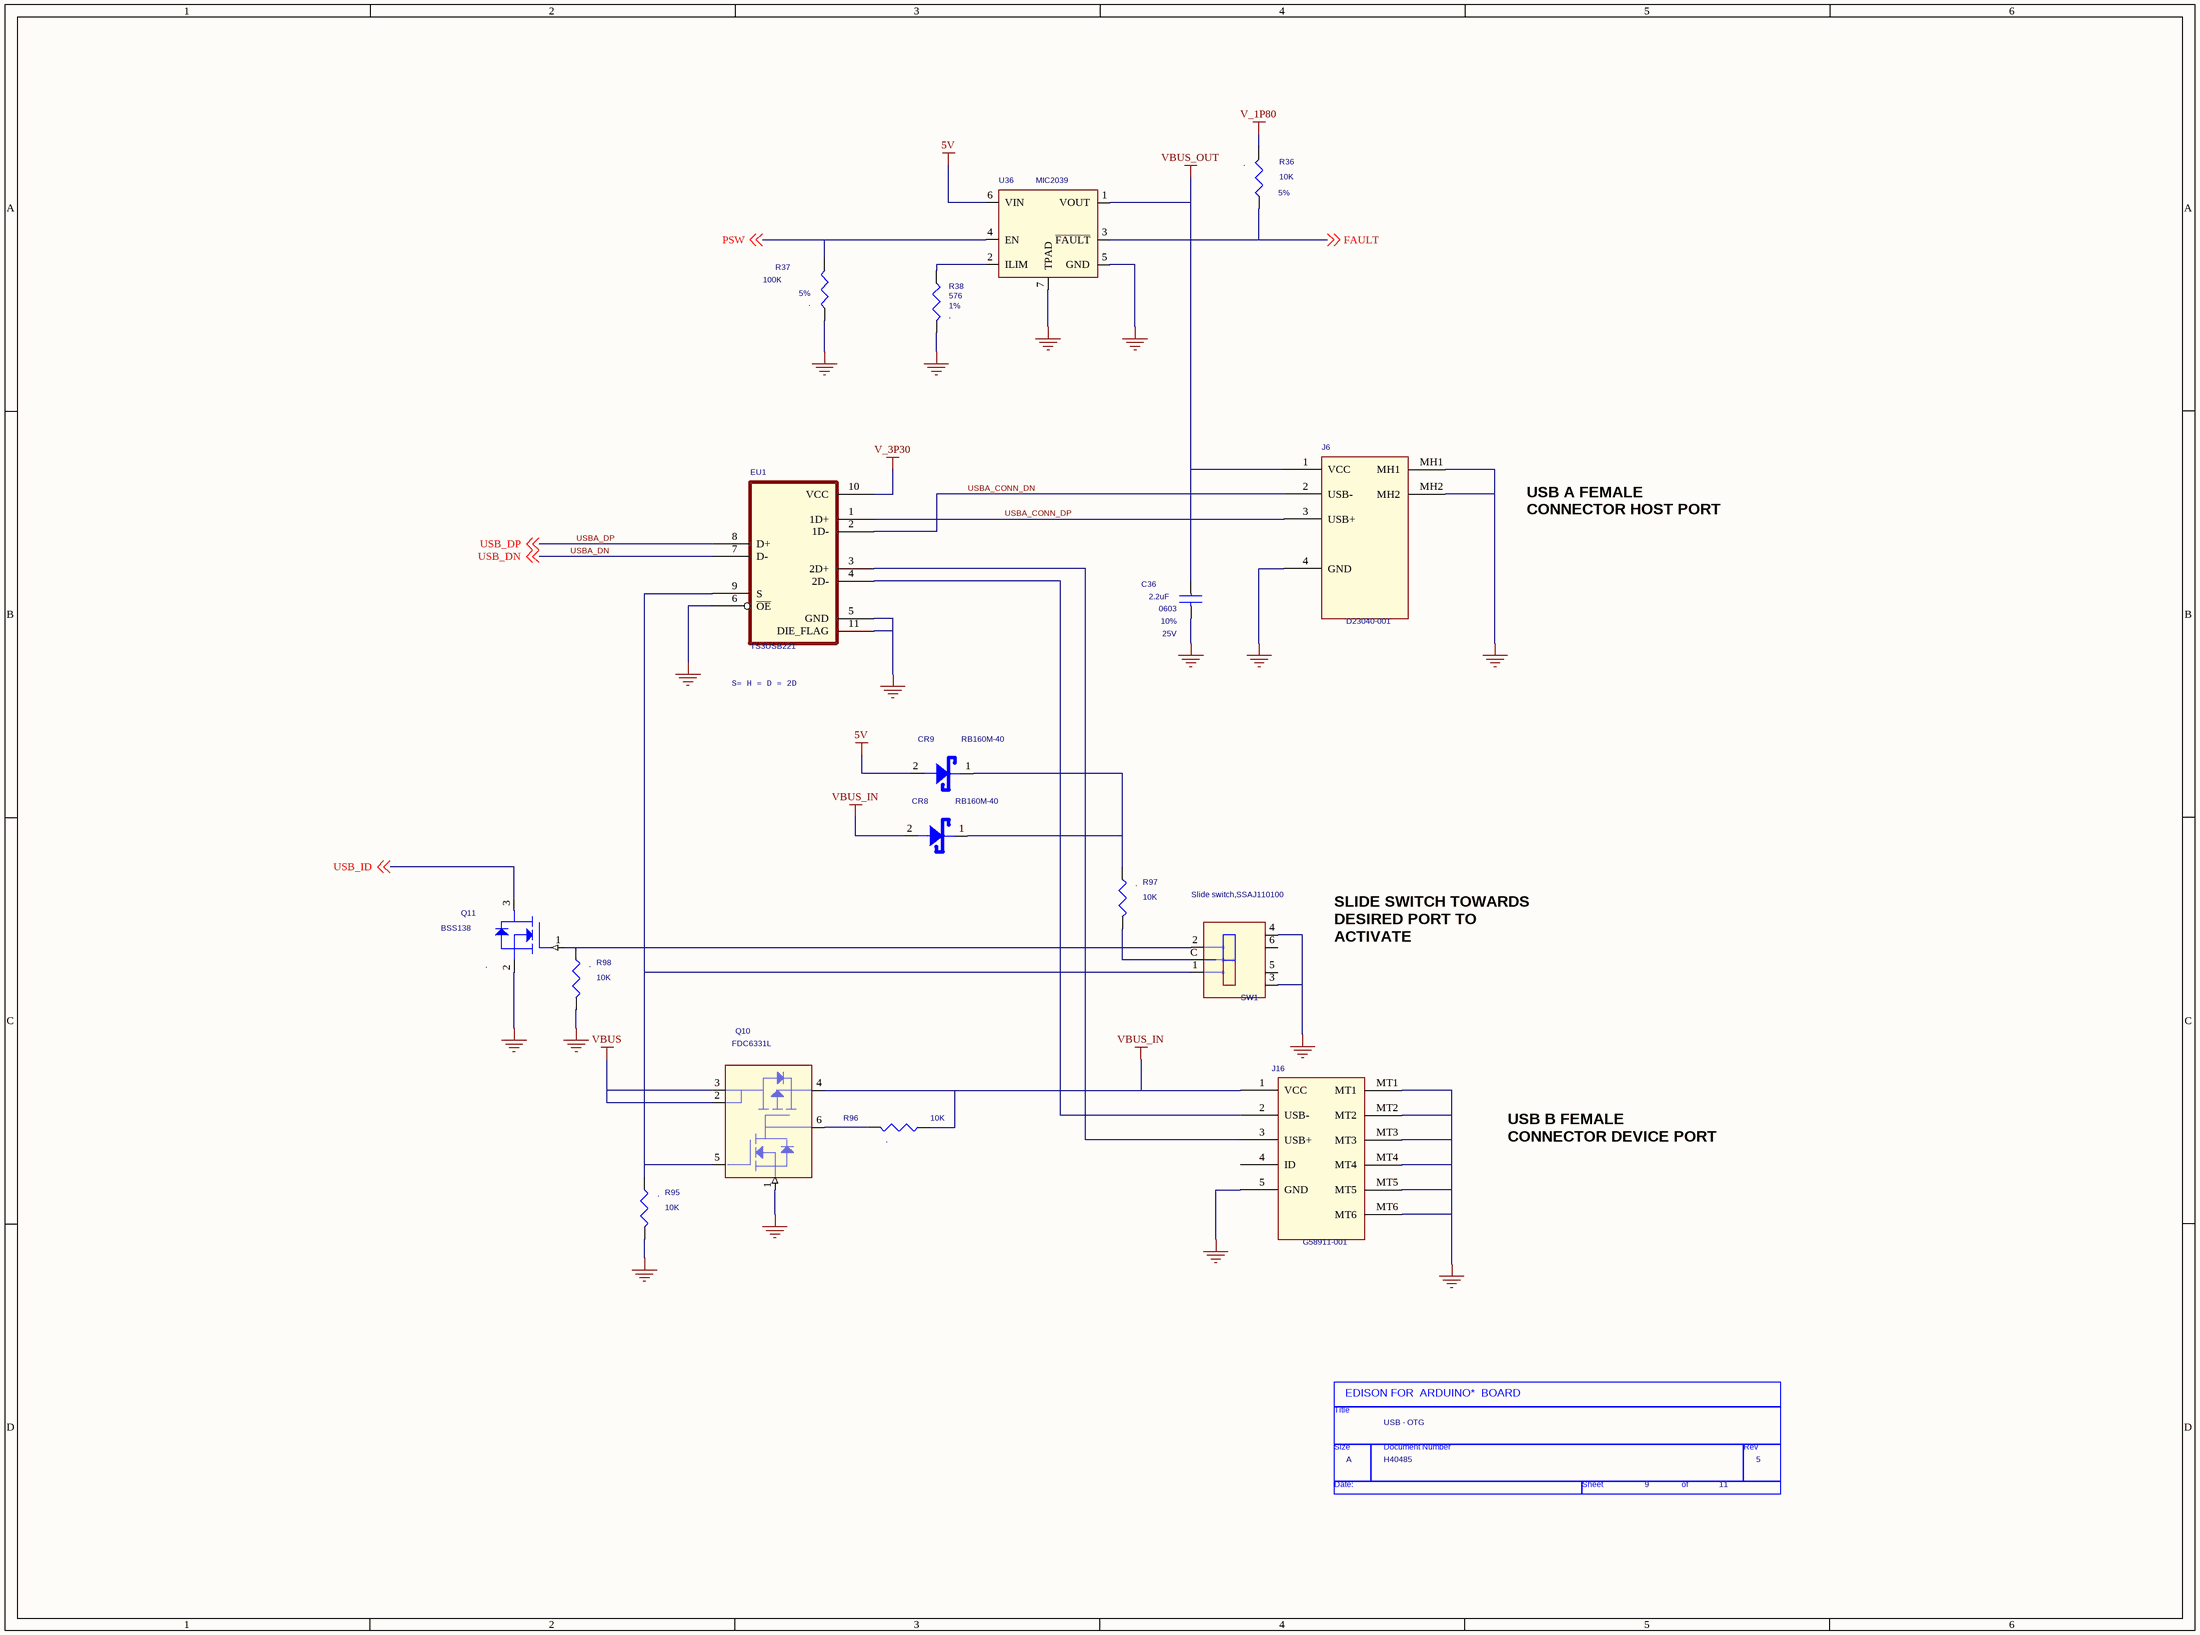
[diagram p2: 09) USB.SchDoc]

### Parts
(Parts that share a designator on the sheet are numbered #1, #2 ... from top to bottom, then left to right.)
*#3  Page Count: 11  Page Number: 9  Page Size: A  Title: USB - OTG  RevCode: 5  Doc: H40485  (hidden comment: TitleBlock0)  (graphical)
C36  2.2uF  TOL: 10%  SIZE: 0603  RATING: 25V  [SMC0603_hi_value]
CR8  RB160M-40  [SOD123_67x106]
CR9  RB160M-40  [SOD123_67x106]
EU1  TS3USB221  [LCC10_P5MM_EP65X94]
J6  D23040-001  [RCPT_USB_5P_DIP_SM]
J16  G58911-001  [RCPT_USB_5P_DIP_SM]
Q10  FDC6331L  [SSOT-6]
Q11  BSS138  NO_STUFF: .  [SOT23]
R36  10K  NO_STUFF: .  TOL: 5%  [SMR0201]
R37  100K  NO_STUFF: .  TOL: 5%  [SMR0201]
R38  576  NO_STUFF: .  TOL: 1%  [SMR0201]
R95  10K  NO_STUFF: .  [SMR0201]
R96  10K  NO_STUFF: .  [SMR0201]
R97  10K  NO_STUFF: .  [SMR0201]
R98  10K  NO_STUFF: .  [SMR0201]
SW1  Slide switch,SSAJ110100  [sw_ssaj110100_3p]
U36  MIC2039  [DFN_6P_2X2MM]

### Nets
5V: CR9.2(Anode) U36.6(VIN)
GND: C36.2 EU1.5(GND) EU1.6(~{OE}) EU1.11(DIE_FLAG) J6.4(GND) J6.MH1 J6.MH2 J16.5(GND) J16.MT1 J16.MT2 J16.MT3 J16.MT4 J16.MT5 J16.MT6 Q10.1(R2) Q11.2(S) R37.2 R38.2 R95.1 R98.1 SW1.3(MT_1) SW1.4(MT_2) U36.5(GND) U36.7(TPAD)  [project net PWRBTN_GND]
V_1P80: R36.2
V_3P30: EU1.10(VCC)
VBUS: Q10.2(VOUT2) Q10.3(VOUT1)
VBUS_IN: CR8.2(Anode) J16.1(VCC) Q10.4(VOUT) R96.1
VBUS_OUT: C36.1 J6.1(VCC) U36.1(VOUT)
FAULT: R36.1 U36.3(~{FAULT}) ; off-sheet FAULT
PSW: R37.1 U36.4(EN) ; off-sheet PSW
USB_DN: EU1.7(D-) ; off-sheet USB_DN  [also labelled USBA_DN]
USB_DP: EU1.8(D+) ; off-sheet USB_DP  [also labelled USBA_DP]
USB_ID: Q11.3(D) ; off-sheet USB_ID
USBA_CONN_DN: EU1.2(1D-) J6.2(USB-)
USBA_CONN_DP: EU1.1(1D+) J6.3(USB+)
NetCR8_1: CR8.1(Cathode) CR9.1(Cathode) R97.2
NetEU1_3: EU1.3(2D+) J16.3(USB+)
NetEU1_4: EU1.4(2D-) J16.2(USB-)
NetEU1_9: EU1.9(S) Q10.5(ON) R95.2 SW1.1
NetQ10_6: Q10.6(R1C1) R96.2
NetQ11_1: Q11.1(G) R98.2 SW1.2
NetR38_1: R38.1 U36.2(ILIM)
NetR97_1: R97.1 SW1.C

Not connected (* = marked no-connect by the designer): J16 4(ID); SW1 5(MT_3) 6(MT_4)

### Notes on the sheet
- USB A FEMALE
  CONNECTOR HOST PORT
- S= H = D = 2D
- SLIDE SWITCH TOWARDS
  DESIRED PORT TO
  ACTIVATE
- USB B FEMALE
  CONNECTOR DEVICE PORT
- (in symbol TitleBlock0) EDISON FOR  ARDUINO*  BOARD; Title; Size; Document Number; Rev; Date:; Sheet; of

### Library data of the parts
C36 = CAPC,X5R,0603,25V,10%,2.2uF: CAPC,X5R,0603,2.2UF,25.00V,+/- 10%; PART_NUMBER: 602433-091; FINANCE: x; LEAD_FREE: YES; NO_STUFF: .; ROOM: USB; BOM: x; DEVICE: 602433-091; IPN: 602433-091
CR8 CR9 = DIO,SHTKY,SOD123,RB160M-40: DIODE SHKY 1A 40V SOD123; Manufacturer P/N: RM160M-40; Manufacturer: Pillips; FINANCE: x; LEAD_FREE: YES; IPN: E58800-001; NO_STUFF: .; Device: E58800-001; BOM: x; PART_NUMBER: E58800-001
EU1 = IC,TS3USB221,SON10,MPlex_0: IC,LIN,ANALOGSWITCH,SON,TS3USB22,; PART_NUMBER: G67765-001; NO_STUFF: .; LEAD_FREE: YES; BOM: x; ROOM: NO_ROOM; DEVICE: G67765-001; IPN: G67765-001; FINANCE: x
J6 = CON4,USB,RA,_4: CONN,MISC,5P,MICRO USB,B TYPE,RECEPT,2013499-1; BOM: x; LEAD_FREE: YES; NO_STUFF: .; FINANCE: x; IPN: D23040-001; DEVICE: D23040-001; PART_NUMBER: D23040-001
J16 = CON4,USB,RA,_1: CONN,MISC,5P,MICRO USB,B TYPE,RECEPT,2013499-1; BOM: x; LEAD_FREE: YES; NO_STUFF: .; FINANCE: x; IPN: G58911-001; DEVICE: G58911-001; PART_NUMBER: G58911-001
Q10 = IC,FDC6331,LOADSWI: as Q12 on sheet 10) Button and I_O Conn; IPN: G79283-001; Device: fdc6331; FINANCE: x; PART NUMBER: G79283-001
Q11 = XSTR,BSS138,FET,NCH,SOT23: as Q8 on sheet 11) TEST POINTS; BOM: x; IPN: C81974-001; PART_NUMBER: C81974-001
R36 = RESD,0201,5%,1/20W,10K: as R85 on sheet 11) TEST POINTS; RATING: 1/20W; IPN: C80792-002; PART_NUMBER: C80792-002; LEAD_FREE: YES; FINANCE: x
R37 = RESD,0201,5%,1/20W,100K: RES D,0201,100.00 kOHM,5.00%,1/20W,YES; Device: C80792-011; BOM: x; ROOM: APE_PMIC_MISC; RATING: 1/20W; IPN: C80792-011; PART_NUMBER: C80792-011; LEAD_FREE: YES; FINANCE: x
R38 = RESD,0201,1%,1/20W,562: as R86 on sheet 11) TEST POINTS; LEAD_FREE: YES; FINANCE: x
R95-R98 = RESD,0201,5%,1/20W,10K: as R100 on sheet 10) Button and I_O Conn; RATING: 1/20W; IPN: C80792-002; PART_NUMBER: C80792-002; LEAD_FREE: YES; FINANCE: x
SW1 = SWCH,Slide,SPST,SMT,SSAJ110100: Part_Number: G99612-001; MFR: ALPS; FINANCE: x; LEAD_FREE: YES; ROOM: NO_ROOM; BOM: x; Device: G99612-001; IPN: G99612-001; MFR P/N: SSAJ110100
U36 = IC,MIC2039,UsbPwrSwtch_0: IC,LIN,ANALOGSWITCH,DFN,MIC2039,; PART_NUMBER: H40907-001; MFG P/N: MIC2039EYMT; MFG: MICREL; FINANCE: x; LEAD_FREE: YES; NO_STUFF: .; IPN: G11660-001; ROOM: NO_ROOM; BOM: x
*#3 = TitleBlock0: Page Create Date: March  8, 1995

## Sheet 08) SD card.SchDoc
size 447 x 332 mm
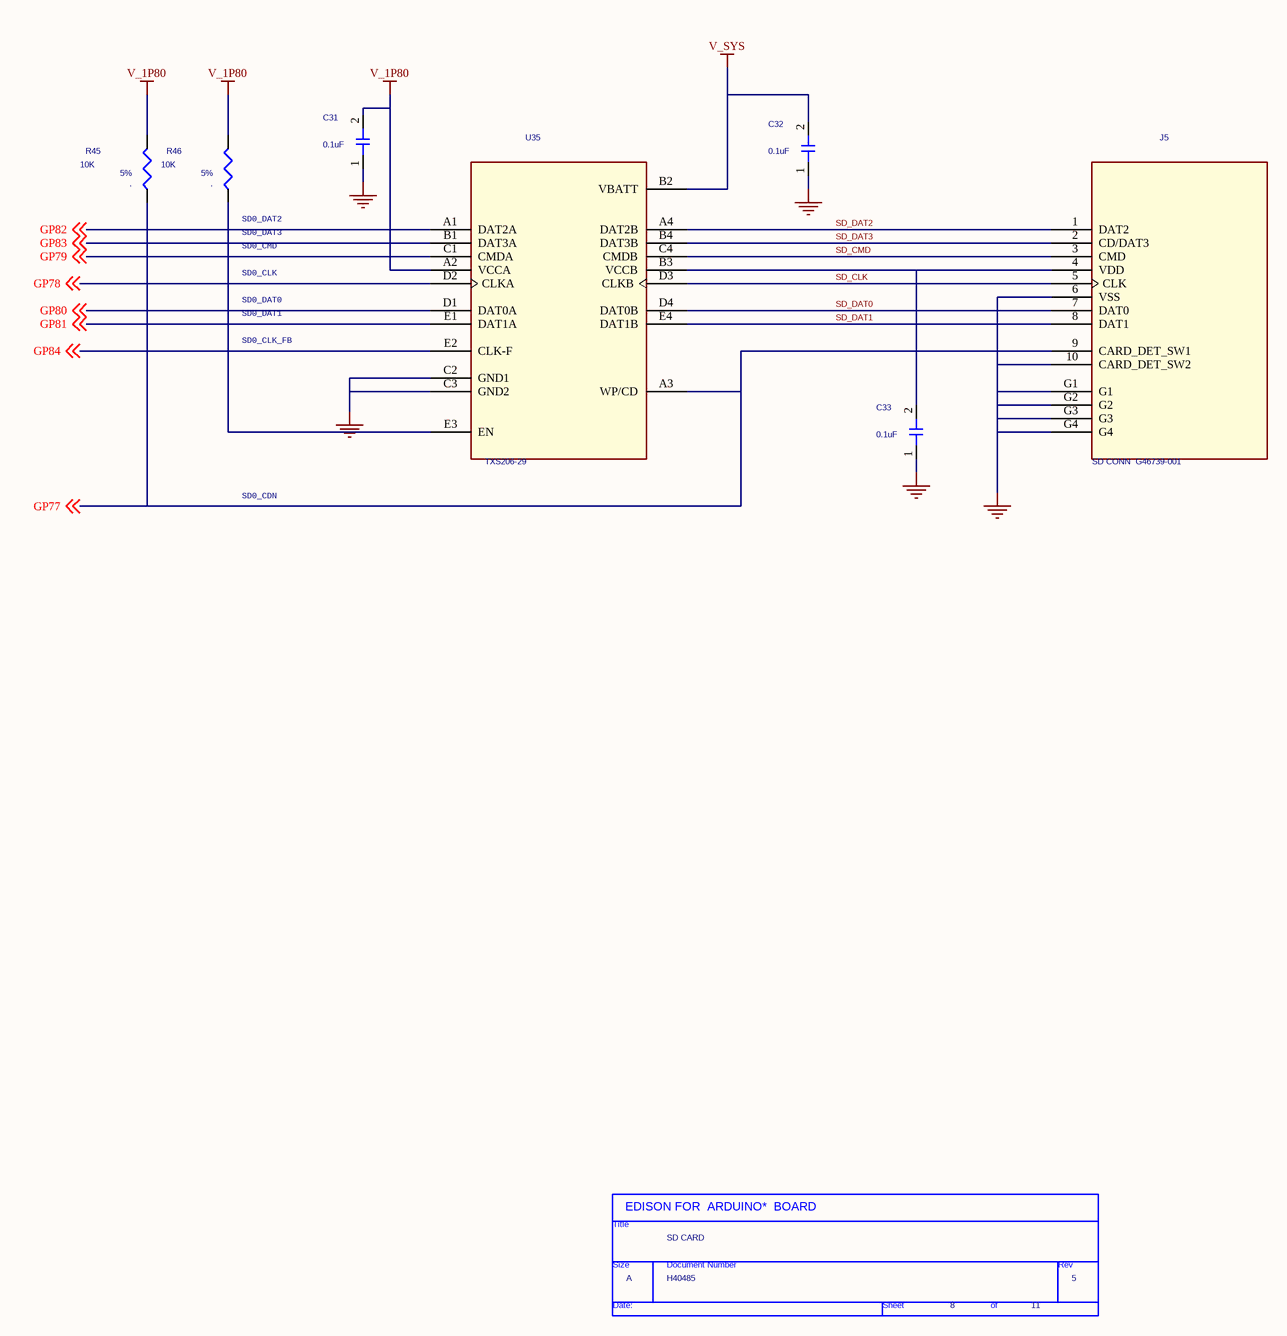
[diagram p3: 08) SD card.SchDoc]

### Parts
(Parts that share a designator on the sheet are numbered #1, #2 ... from top to bottom, then left to right.)
*#4  Page Count: 11  Page Number: 8  Page Size: A  Title: SD CARD  RevCode: 5  Doc: H40485  (hidden comment: TitleBlock0)  (graphical)
C31  0.1uF  [C0201]
C32  0.1uF  [C0201]
C33  0.1uF  [C0201]
J5  SD CONN  G46739-001  [1x8_p1p1mm_micro_sd]
R45  10K  NO_STUFF: .  TOL: 5%  [SMR0201]
R46  10K  NO_STUFF: .  TOL: 5%  [SMR0201]
U35  TXS206-29  [WCSP20]

### Nets
GND: C31.1(END1) C32.1(END1) C33.1(END1) J5.6(VSS) J5.10(CARD_DET_SW2) J5.G1 J5.G2 J5.G3 J5.G4 U35.C2(GND1) U35.C3(GND2)  [project net PWRBTN_GND]
V_1P80: C31.2(END2) R45.1 R46.1 U35.A2(VCCA)
V_SYS: C32.2(END2) U35.B2(VBATT)
GP77: J5.9(CARD_DET_SW1) R45.2 U35.A3(WP/CD) ; off-sheet GP77
GP78: U35.D2(CLKA) ; off-sheet GP78
GP79: U35.C1(CMDA) ; off-sheet GP79
GP80: U35.D1(DAT0A) ; off-sheet GP80
GP81: U35.E1(DAT1A) ; off-sheet GP81
GP82: U35.A1(DAT2A) ; off-sheet GP82
GP83: U35.B1(DAT3A) ; off-sheet GP83
GP84: U35.E2(CLK-F) ; off-sheet GP84
SD_CLK: J5.5(CLK) U35.D3(CLKB)
SD_CMD: J5.3(CMD) U35.C4(CMDB)
SD_DAT0: J5.7(DAT0) U35.D4(DAT0B)
SD_DAT1: J5.8(DAT1) U35.E4(DAT1B)
SD_DAT2: J5.1(DAT2) U35.A4(DAT2B)
SD_DAT3: J5.2(CD/DAT3) U35.B4(DAT3B)
NetC33_2: C33.2(END2) J5.4(VDD) U35.B3(VCCB)
NetR46_2: R46.2 U35.E3(EN)

### Notes on the sheet
- SD0_CMD
- (near R46) SD0_DAT2
- (near R46) SD0_DAT3
- SD0_CLK
- SD0_DAT0
- SD0_DAT1
- SD0_CLK_FB
- SD0_CDN
- (in symbol TitleBlock0) EDISON FOR  ARDUINO*  BOARD; Title; Size; Document Number; Rev; Date:; Sheet; of

### Library data of the parts
C31 = CAP: as C49 on sheet 10) Button and I_O Conn; VOLTAGE: ?; PERC: ?; PATH: ?
C32 C33 = CAP: CAPC,X5R,0201,0.1UF,10.00V,+/- 10%; Manufacturer: GENERIC; PART_NUMBER: C83410-014; OriginalSymbolOrigin: (-50,50); Code: 27; Process: SMD; VOLTAGE: ?; PERC: ?; PATH: ?
J5 = CON8,MICROSD,NOACO_4: CONN,8-PIN,MICROSD MEM CARD,SMT,PUSH/PULL,1.42H,1040310811; NO_STUFF: .; Device: REQ3437; MFG P/N: 473092651; LEAD_FREE: YES; BOM: x; PART_NUMBER: G46739-001; IPN: G46739-001; FINANCE: x; PART NUMBER: G46739-001
R45 R46 = RESD,0201,5%,1/20W,10K: as R48 on sheet 10) Button and I_O Conn; RATING: 1/20W; IPN: C80792-002; PART_NUMBER: C80792-002; LEAD_FREE: YES; FINANCE: x
U35 = TXS0206-29: IC,LOG,TRANSCEIVE,CSP,TXS0206-29,NI3S,; PART_NUMBER: H40962-001; FINANCE: x; LEAD_FREE: YES; IPN: NEW; NO_STUFF: .; MFG PN: TXS0206-29YFPR; BOM: x; Device: TXS0206
*#4 = TitleBlock0: Page Create Date: March  8, 1995

## Sheet 07) DIGITAL TRANSLATION.SchDoc
size 701 x 447 mm
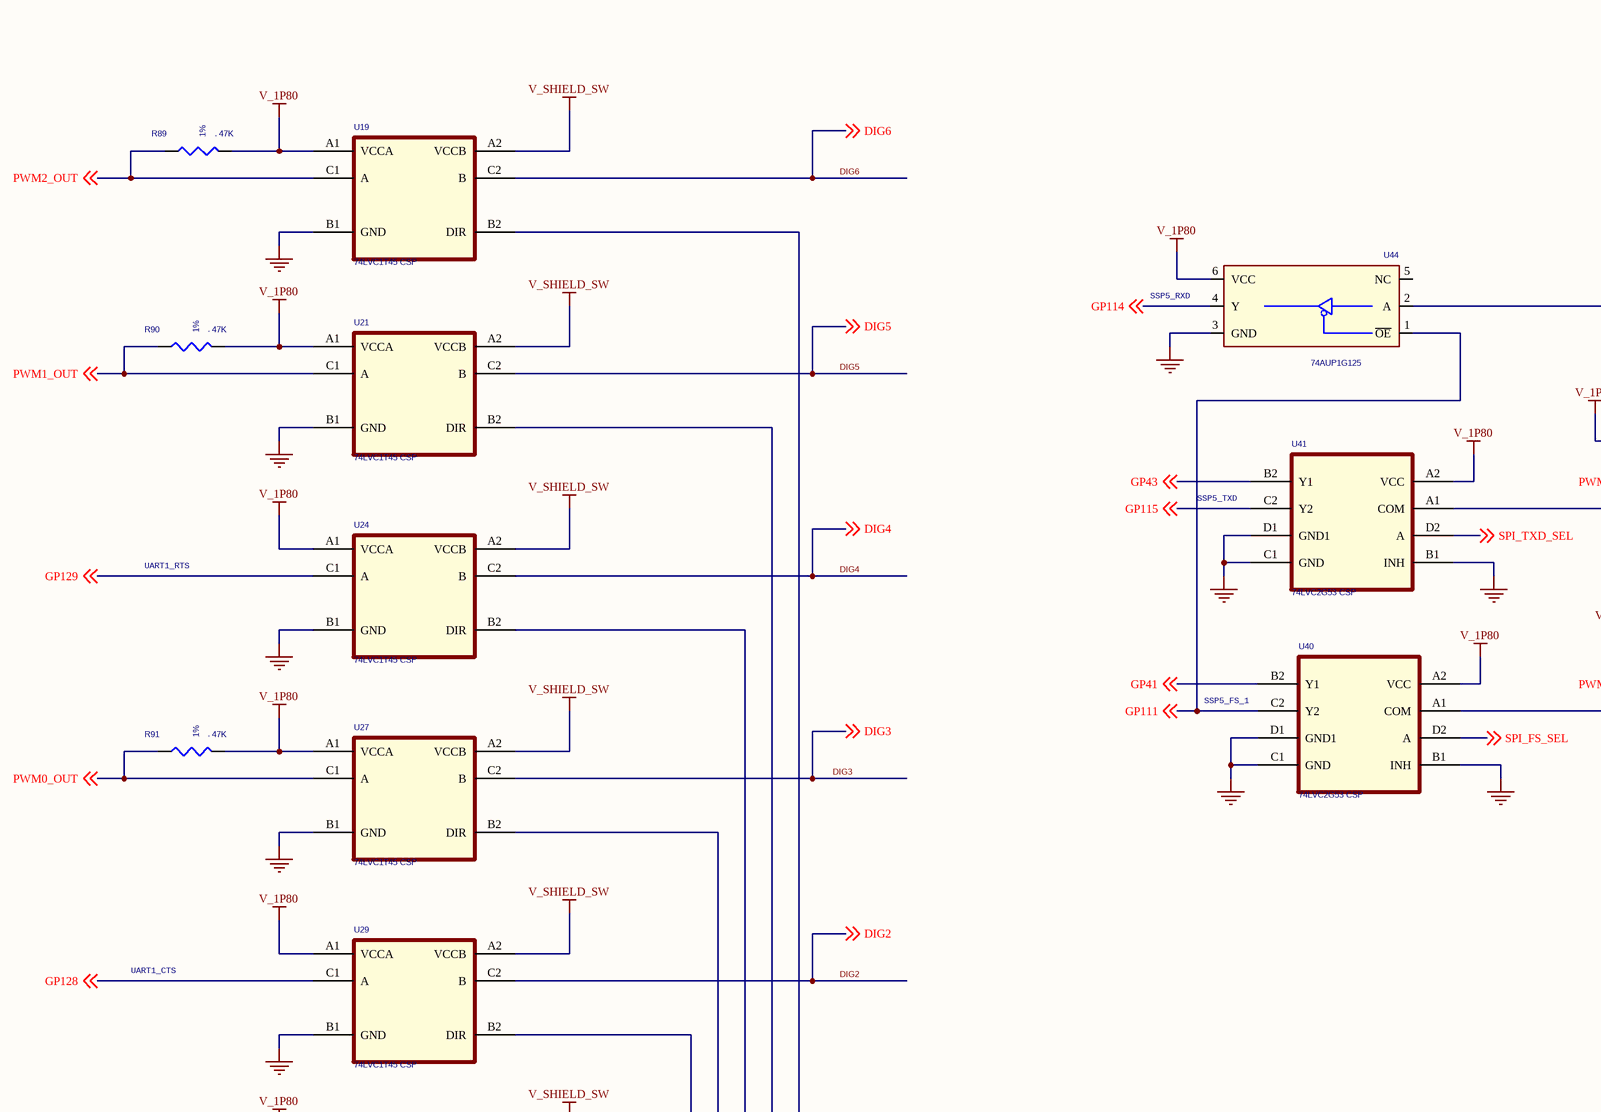
[diagram p4: 07) DIGITAL TRANSLATION.SchDoc, top left]
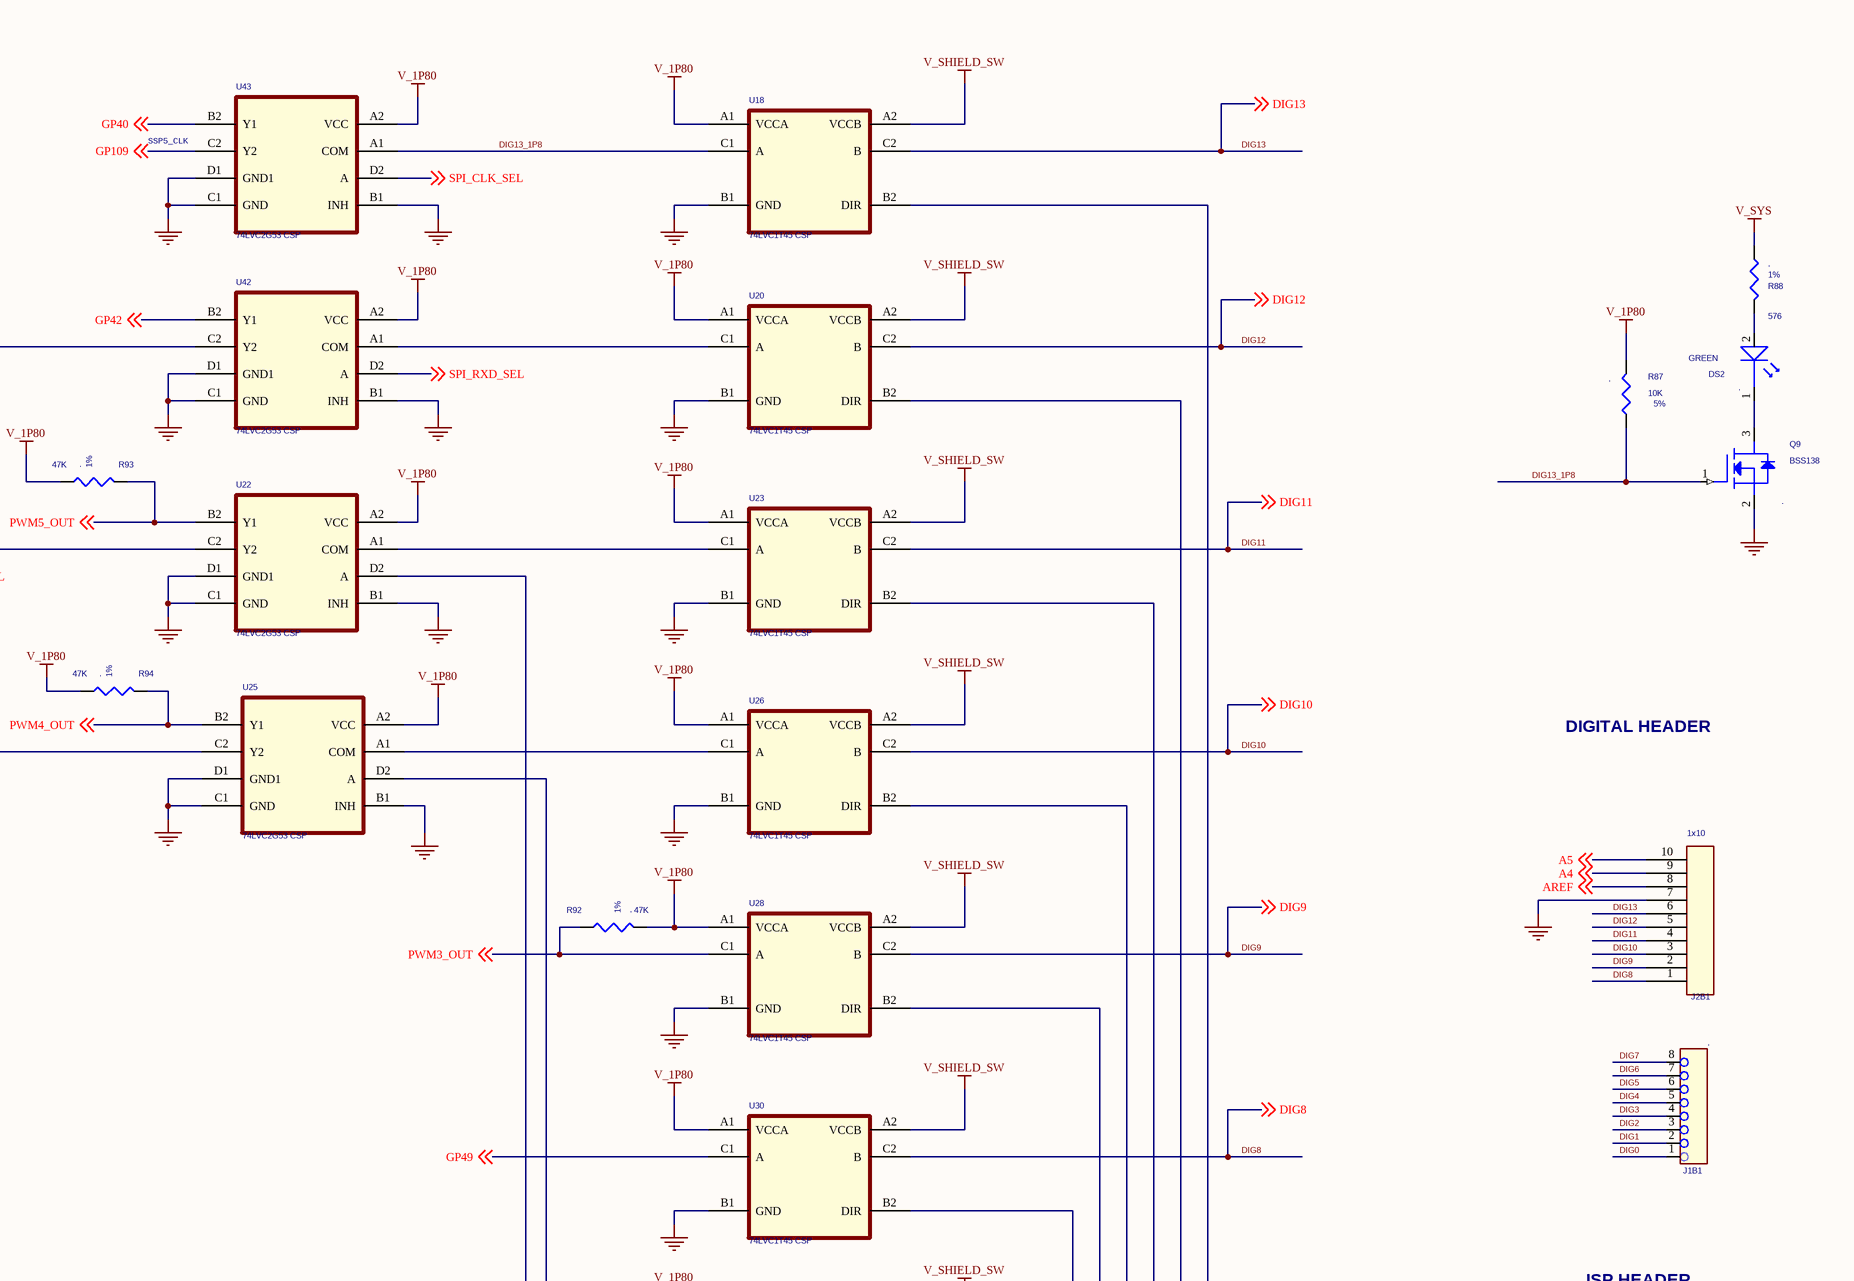
[diagram p5: 07) DIGITAL TRANSLATION.SchDoc, top right]
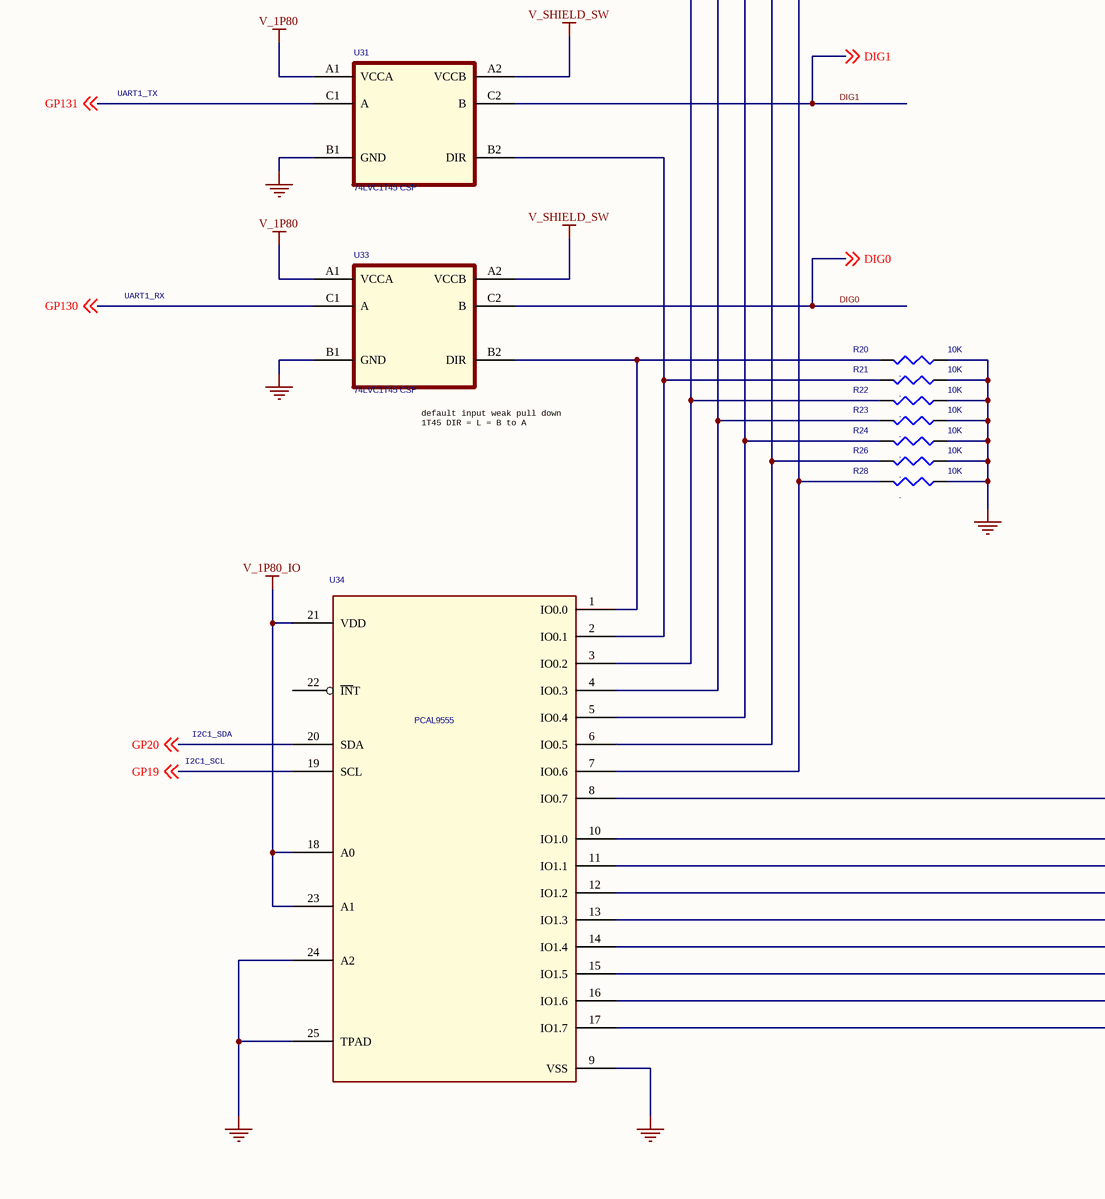
[diagram p6: 07) DIGITAL TRANSLATION.SchDoc, bottom left]
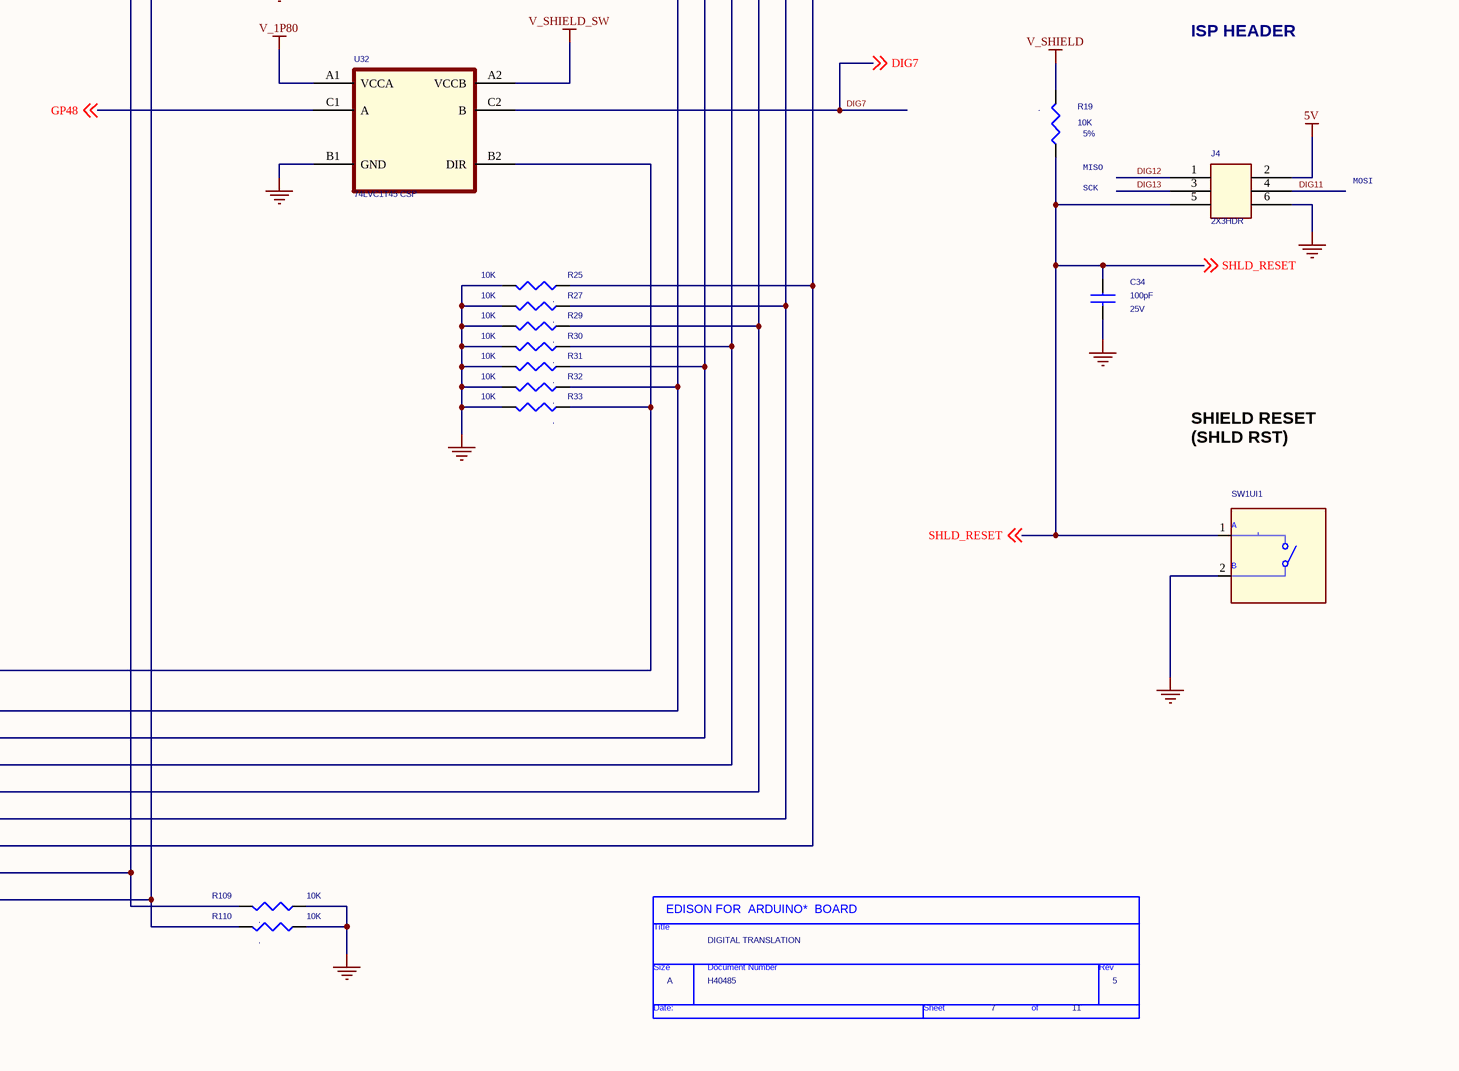
[diagram p7: 07) DIGITAL TRANSLATION.SchDoc, bottom right]

### Parts
(Parts that share a designator on the sheet are numbered #1, #2 ... from top to bottom, then left to right.)
*#5  Page Count: 11  Page Number: 7  Page Size: A  Title: DIGITAL TRANSLATION  RevCode: 5  Doc: H40485  (hidden comment: TitleBlock0)  (graphical)
C34  100pF  RATING: 25V  [SMC0201]
DS2  GREEN  NO_STUFF: .  [smled0402]
J1B1  NO_STUFF: .  [1x8hdr_p100in_th]  (hidden comment: CON8_HDR)
J2B1  1x10  [con10_1x10]
J4  2X3HDR  [HDR_2X3DP]
Q9  BSS138  NO_STUFF: .  [SOT23]
R19  10K  NO_STUFF: .  TOL: 5%  [SMR0201]
R20  10K  NO_STUFF: .  [SMR0201]
R21  10K  NO_STUFF: .  [SMR0201]
R22  10K  NO_STUFF: .  [SMR0201]
R23  10K  NO_STUFF: .  [SMR0201]
R24  10K  NO_STUFF: .  [SMR0201]
R25  10K  NO_STUFF: .  [SMR0201]
R26  10K  NO_STUFF: .  [SMR0201]
R27  10K  NO_STUFF: .  [SMR0201]
R28  10K  NO_STUFF: .  [SMR0201]
R29  10K  NO_STUFF: .  [SMR0201]
R30  10K  NO_STUFF: .  [SMR0201]
R31  10K  NO_STUFF: .  [SMR0201]
R32  10K  NO_STUFF: .  [SMR0201]
R33  10K  NO_STUFF: .  [SMR0201]
R87  10K  NO_STUFF: .  TOL: 5%  [SMR0201]
R88  576  NO_STUFF: .  TOL: 1%  [SMR0201]
R89  47K  TOL: 1%  NO_STUFF: .  [SMR0201]
R90  47K  TOL: 1%  NO_STUFF: .  [SMR0201]
R91  47K  TOL: 1%  NO_STUFF: .  [SMR0201]
R92  47K  TOL: 1%  NO_STUFF: .  [SMR0201]
R93  47K  TOL: 1%  NO_STUFF: .  [SMR0201]
R94  47K  TOL: 1%  NO_STUFF: .  [SMR0201]
R109  10K  NO_STUFF: .  [SMR0201]
R110  10K  NO_STUFF: .  [SMR0201]
SW1UI1  LIGHT TOUCH SWITCH EVQP7J01P  [sw_evqp7_4p]  (value not drawn)
U18  74LVC1T45 CSP  [bga6_5mm_37x57]
U19  74LVC1T45 CSP  [bga6_5mm_37x57]
U20  74LVC1T45 CSP  [bga6_5mm_37x57]
U21  74LVC1T45 CSP  [bga6_5mm_37x57]
U22  74LVC2G53 CSP  [bga8_2X4_P5MM]
U23  74LVC1T45 CSP  [bga6_5mm_37x57]
U24  74LVC1T45 CSP  [bga6_5mm_37x57]
U25  74LVC2G53 CSP  [bga8_2X4_P5MM]
U26  74LVC1T45 CSP  [bga6_5mm_37x57]
U27  74LVC1T45 CSP  [bga6_5mm_37x57]
U28  74LVC1T45 CSP  [bga6_5mm_37x57]
U29  74LVC1T45 CSP  [bga6_5mm_37x57]
U30  74LVC1T45 CSP  [bga6_5mm_37x57]
U31  74LVC1T45 CSP  [bga6_5mm_37x57]
U32  74LVC1T45 CSP  [bga6_5mm_37x57]
U33  74LVC1T45 CSP  [bga6_5mm_37x57]
U34  PCAL9555  [LCC25_S41_5DF89X89MA]
U40  74LVC2G53 CSP  [bga8_2X4_P5MM]
U41  74LVC2G53 CSP  [bga8_2X4_P5MM]
U42  74LVC2G53 CSP  [bga8_2X4_P5MM]
U43  74LVC2G53 CSP  [bga8_2X4_P5MM]
U44  74AUP1G125  [LCC6_P35MM_SQ1P0_NONC_P5H]

### Nets
5V: J4.2(IO_2)
GND: C34.2 J2B1.7 J4.6(IO_6) Q9.2(S) R20.1 R21.1 R22.1 R23.1 R24.1 R25.1 R26.1 R27.1 R28.1 R29.1 R30.1 R31.1 R32.1 R33.1 R109.1 R110.1 SW1UI1.2(B) U18.B1(GND) U19.B1(GND) U20.B1(GND) U21.B1(GND) U22.B1(INH) U22.C1(GND) U22.D1(GND1) U23.B1(GND) U24.B1(GND) U25.B1(INH) U25.C1(GND) U25.D1(GND1) U26.B1(GND) U27.B1(GND) U28.B1(GND) U29.B1(GND) U30.B1(GND) U31.B1(GND) U32.B1(GND) U33.B1(GND) U34.9(VSS) U34.24(A2) U34.25(TPAD) U40.B1(INH) U40.C1(GND) U40.D1(GND1) U41.B1(INH) U41.C1(GND) U41.D1(GND1) U42.B1(INH) U42.C1(GND) U42.D1(GND1) U43.B1(INH) U43.C1(GND) U43.D1(GND1) U44.3(GND)  [project net PWRBTN_GND]
V_1P80: R87.2 R89.2 R90.2 R91.2 R92.2 R93.2 R94.2 U18.A1(VCCA) U19.A1(VCCA) U20.A1(VCCA) U21.A1(VCCA) U22.A2(VCC) U23.A1(VCCA) U24.A1(VCCA) U25.A2(VCC) U26.A1(VCCA) U27.A1(VCCA) U28.A1(VCCA) U29.A1(VCCA) U30.A1(VCCA) U31.A1(VCCA) U32.A1(VCCA) U33.A1(VCCA) U40.A2(VCC) U41.A2(VCC) U42.A2(VCC) U43.A2(VCC) U44.6(VCC)
V_1P80_IO: U34.18(A0) U34.21(VDD) U34.23(A1)
V_SHIELD: R19.2
V_SHIELD_SW: U18.A2(VCCB) U19.A2(VCCB) U20.A2(VCCB) U21.A2(VCCB) U23.A2(VCCB) U24.A2(VCCB) U26.A2(VCCB) U27.A2(VCCB) U28.A2(VCCB) U29.A2(VCCB) U30.A2(VCCB) U31.A2(VCCB) U32.A2(VCCB) U33.A2(VCCB)
V_SYS: R88.2
A4: J2B1.9 ; off-sheet A4
A5: J2B1.10 ; off-sheet A5
AREF: J2B1.8 ; off-sheet AREF
DIG0: J1B1.1 U33.C2(B) ; off-sheet DIG0
DIG1: J1B1.2 U31.C2(B) ; off-sheet DIG1
DIG2: J1B1.3 U29.C2(B) ; off-sheet DIG2
DIG3: J1B1.4 U27.C2(B) ; off-sheet DIG3
DIG4: J1B1.5 U24.C2(B) ; off-sheet DIG4
DIG5: J1B1.6 U21.C2(B) ; off-sheet DIG5
DIG6: J1B1.7 U19.C2(B) ; off-sheet DIG6
DIG7: J1B1.8 U32.C2(B) ; off-sheet DIG7
DIG8: J2B1.1 U30.C2(B) ; off-sheet DIG8
DIG9: J2B1.2 U28.C2(B) ; off-sheet DIG9
DIG10: J2B1.3 U26.C2(B) ; off-sheet DIG10
DIG11: J2B1.4 J4.4(IO_4) U23.C2(B) ; off-sheet DIG11
DIG12: J2B1.5 J4.1(IO_1) U20.C2(B) ; off-sheet DIG12
DIG13: J2B1.6 J4.3(IO_3) U18.C2(B) ; off-sheet DIG13
DIG13_1P8: Q9.1(G) R87.1 U18.C1(A) U43.A1(COM)
GP19: U34.19(SCL) ; off-sheet GP19
GP20: U34.20(SDA) ; off-sheet GP20
GP40: U43.B2(Y1) ; off-sheet GP40
GP41: U40.B2(Y1) ; off-sheet GP41
GP42: U42.B2(Y1) ; off-sheet GP42
GP43: U41.B2(Y1) ; off-sheet GP43
GP48: U32.C1(A) ; off-sheet GP48
GP49: U30.C1(A) ; off-sheet GP49
GP109: U43.C2(Y2) ; off-sheet GP109
GP111: U40.C2(Y2) U44.1(~{OE}) ; off-sheet GP111
GP114: U44.4(Y) ; off-sheet GP114
GP115: U41.C2(Y2) ; off-sheet GP115
GP128: U29.C1(A) ; off-sheet GP128
GP129: U24.C1(A) ; off-sheet GP129
GP130: U33.C1(A) ; off-sheet GP130
GP131: U31.C1(A) ; off-sheet GP131
PWM0_OUT: R91.1 U27.C1(A) ; off-sheet PWM0_OUT
PWM1_OUT: R90.1 U21.C1(A) ; off-sheet PWM1_OUT
PWM2_OUT: R89.1 U19.C1(A) ; off-sheet PWM2_OUT
PWM3_OUT: R92.1 U28.C1(A) ; off-sheet PWM3_OUT
PWM4_OUT: R94.1 U25.B2(Y1) ; off-sheet PWM4_OUT
PWM5_OUT: R93.1 U22.B2(Y1) ; off-sheet PWM5_OUT
SHLD_RESET: C34.1 J4.5(IO_5) R19.1 SW1UI1.1(A) ; off-sheet SHLD_RESET
SPI_CLK_SEL: U43.D2(A) ; off-sheet SPI_CLK_SEL
SPI_FS_SEL: U40.D2(A) ; off-sheet SPI_FS_SEL
SPI_RXD_SEL: U42.D2(A) ; off-sheet SPI_RXD_SEL
SPI_TXD_SEL: U41.D2(A) ; off-sheet SPI_TXD_SEL
NetDS2_1: DS2.1(LED1) Q9.3(D)
NetDS2_2: DS2.2(LED2) R88.1
NetR20_2: R20.2 U33.B2(DIR) U34.1(IO0.0)
NetR21_2: R21.2 U31.B2(DIR) U34.2(IO0.1)
NetR22_2: R22.2 U29.B2(DIR) U34.3(IO0.2)
NetR23_2: R23.2 U27.B2(DIR) U34.4(IO0.3)
NetR24_2: R24.2 U24.B2(DIR) U34.5(IO0.4)
NetR25_2: R25.2 U18.B2(DIR) U34.15(IO1.5)
NetR26_2: R26.2 U21.B2(DIR) U34.6(IO0.5)
NetR27_2: R27.2 U20.B2(DIR) U34.14(IO1.4)
NetR28_2: R28.2 U19.B2(DIR) U34.7(IO0.6)
NetR29_2: R29.2 U23.B2(DIR) U34.13(IO1.3)
NetR30_2: R30.2 U26.B2(DIR) U34.12(IO1.2)
NetR31_2: R31.2 U28.B2(DIR) U34.11(IO1.1)
NetR32_2: R32.2 U30.B2(DIR) U34.10(IO1.0)
NetR33_2: R33.2 U32.B2(DIR) U34.8(IO0.7)
NetR109_2: R109.2 U22.D2(A) U34.16(IO1.6)
NetR110_2: R110.2 U25.D2(A) U34.17(IO1.7)
NetU20_C1: U20.C1(A) U42.A1(COM)
NetU22_A1: U22.A1(COM) U23.C1(A)
NetU22_C2: U22.C2(Y2) U41.A1(COM)
NetU25_A1: U25.A1(COM) U26.C1(A)
NetU25_C2: U25.C2(Y2) U40.A1(COM)
NetU42_C2: U42.C2(Y2) U44.2(A)

Not connected (* = marked no-connect by the designer): U34 22(~{IN}T); U44 5(NC)

### Notes on the sheet
- (near U43) SSP5_CLK
- (near U44) SSP5_RXD
- SSP5_TXD
- UART1_RTS
- DIGITAL HEADER
- SSP5_FS_1
- UART1_CTS
- UART1_TX
- ISP HEADER
- UART1_RX
- (near R19) MISO
- (near R19) SCK
- MOSI
- (near U33) default input weak pull down
  1T45 DIR = L = B to A
- SHIELD RESET
  (SHLD RST)
- I2C1_SCL
- I2C1_SDA
- (in symbol TitleBlock0) EDISON FOR  ARDUINO*  BOARD; Title; Size; Document Number; Rev; Date:; Sheet; of

### Library data of the parts
C34 = CAPC,COG,0201,25V,5%,100pF: CAPC,C0G,0201,100.000PF,25.000V,+/- 5%; PART_NUMBER: D70542-001; NO_STUFF: .; LEAD_FREE: YES; BOM: x; ROOM: BATTERY; IPN: D70542-001; Device: D70542-001; FINANCE: x
DS2 = LED,SMT,GREEN,V,0402: as DS1 on sheet 11) TEST POINTS; IPN: E54986-003; PART_NUMBER: E54986-003; FINANCE: x
J1B1 = CON8,HDR,TH,0.1in,E70026-001: CONN,PLUG,VERT,1X8,2.54MM,THM,90147_1108; FINANCE: x; LEAD_FREE: YES; IPN: H46118-001; BOM: x; Device: H46118-001; PART_NUMBER: H46118-001
J2B1 = CON10,1X10,0.1,0.093,E74918-001: CONN,PLUG,VERT,1X10,2.54MM,THM,10CIRCUITS,90147_1110; ROOM: NO_ROOM; NO_STUFF: .; LEAD_FREE: YES; IPN: H46116-001; PART_NUMBER: H46116-001; PART NUMBER: H46116-001
J4 = CON6,HDR,TH,0_0.1,C77978-007: CONN,HDR,2X3,PLG,VT,0.1,0.93 ST; PART_NUMBER: H18587-001; FINANCE: x; LEAD_FREE: YES; NO_STUFF: .; BOM: x; IPN: H18587-001; Device: H18587-001
Q9 = XSTR,BSS138,FET,NCH,SOT23: as Q8 on sheet 11) TEST POINTS; BOM: x; IPN: C81974-001; PART_NUMBER: C81974-001
R19 R87 = RESD,0201,5%,1/20W,10K: as R85 on sheet 11) TEST POINTS; RATING: 1/20W; IPN: C80792-002; PART_NUMBER: C80792-002; LEAD_FREE: YES; FINANCE: x
R20-R33 R109 R110 = RESD,0201,5%,1/20W,10K: as R100 on sheet 10) Button and I_O Conn; RATING: 1/20W; IPN: C80792-002; PART_NUMBER: C80792-002; LEAD_FREE: YES; FINANCE: x
R88 = RESD,0201,1%,1/20W,562: as R86 on sheet 11) TEST POINTS; LEAD_FREE: YES; FINANCE: x
R89-R94 = RESD,0201,1%,1/20W,47K: RES_D,0201,47.0kOHM,1.00%,1/20W,; PART_NUMBER: C48657-118; FINANCE: x; LEAD_FREE: YES; BOM: x; IPN: C48657-118; RATING: 1/20W; Device: C48657-118
SW1UI1 = SWITCH,EVQP7J01P,4P,PWR_0: CONN,SWIT,TACTILE,VT,SPST,2,50.0 mA,SMT>; PART_NUMBER: D90553-001; MFG: Panasonic; BOM: x; ROOM: UI_BUTTONS; NO_STUFF: .; LEAD_FREE: YES; MFG P/N: EVQP7J01P; IPN: D90553-001; FINANCE: x; DEVICE: D90553-001
U18-U21 U23 U24 U26-U33 = IC,74LVC1T45,LOG,BGA6,TRNSSVR: IC,LOG,TRANSCEIVE,CSP,SN74LVC1T45,NI3S,; FINANCE: x; LEAD_FREE: YES; IPN: G42189-001; NO_STUFF: .; MFG: TI; MFG P/N: 74LVC1T45YZPR; BOM: x; DEVICE: G42189-001; PART_NUMBER: G42189-001
U22 U25 U40-U43 = IC,74LVC2G53: IC,LOG,MULTIPLEX,uBGA,742G53,NI,; PART_NUMBER: H40914-001; FINANCE: x; LEAD_FREE: YES; IPN: NEED; NO_STUFF: .; MFG: TI; BOM: x; DEVICE: LVC2G53; MFG P/N: 74LVC2G53
U34 = IC,PCAL9555,16bit_GPIO: IC,LIN,INTFC,QFN,PCAL9555,GPIO,; NO_STUFF: .; DEVICE: H31921-001; LEAD_FREE: YES; BOM: x; IPN: H31921-001; Part_Number: H31921-001; FINANCE: x; PART NUMBER: H31921-001
U44 = IC,74AUP1G125,LOG,LCC6,BUFFER: IC,LOG,TRANSCEIVE,DFN,74AUP1G125,NI3S,; ROOM: NO_ROOM; FINANCE: x; LEAD_FREE: YES; IPN: H22984-001; MFG: TI; MFG P/N: 74AUP1G125GF; NO_STUFF: .; BOM: x; DEVICE: H22984-001; PART_NUMBER: H22984-001
*#5 = TitleBlock0: Page Create Date: March  8, 1995

## Sheet 06) ANALOG TRANSLATION.SchDoc
size 701 x 447 mm
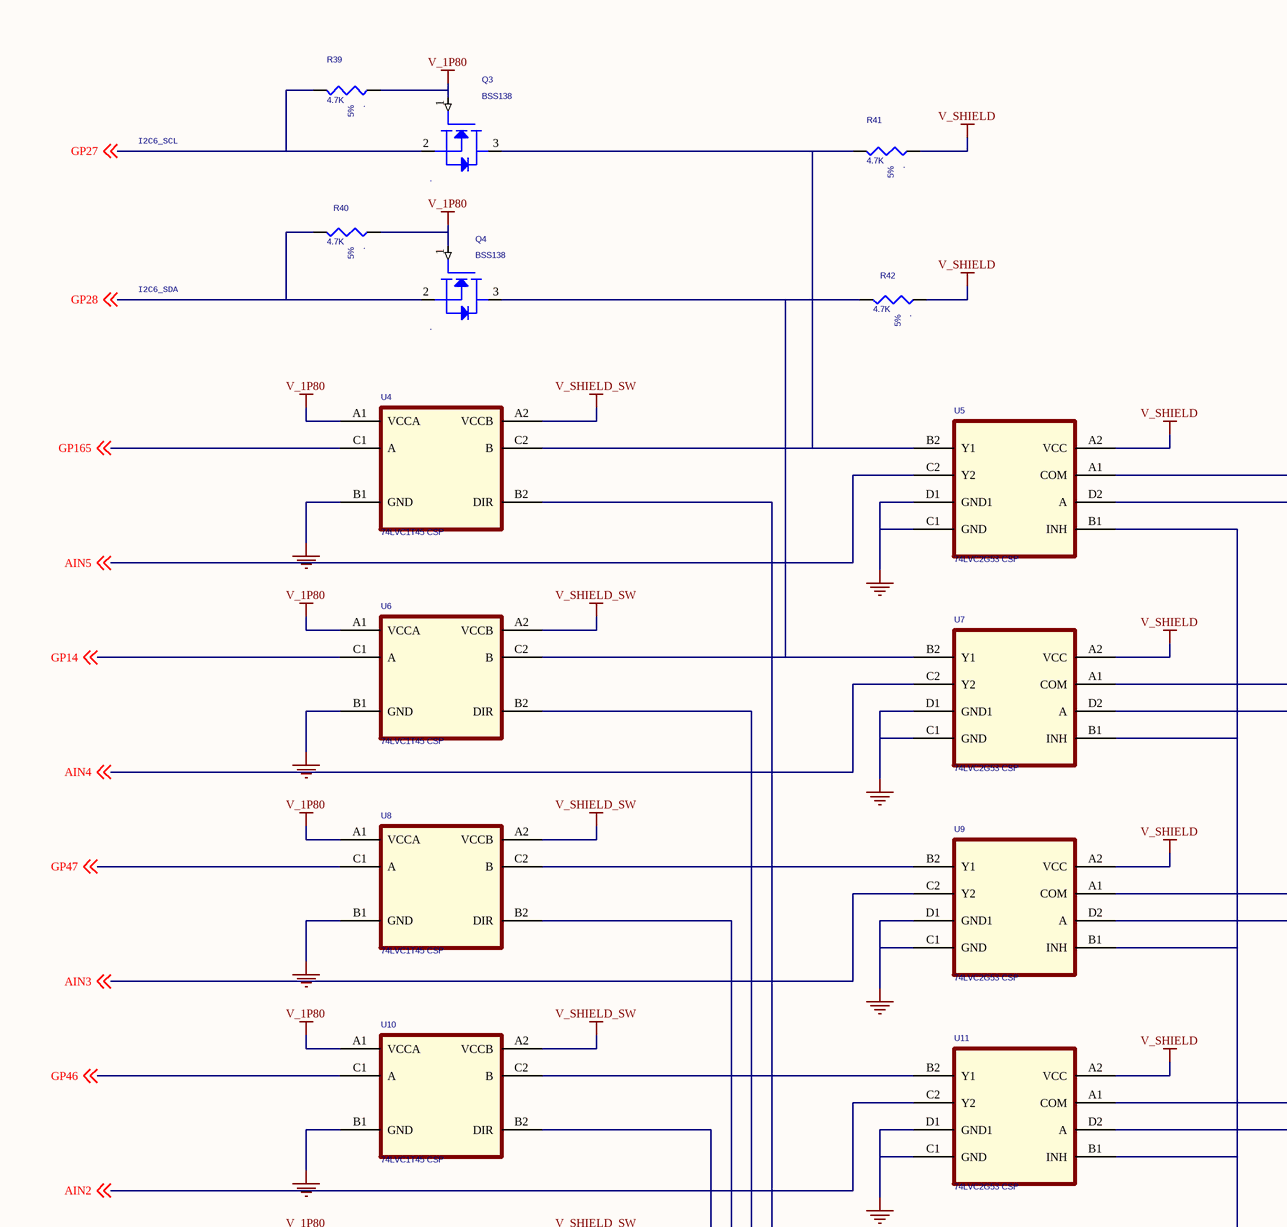
[diagram p8: 06) ANALOG TRANSLATION.SchDoc, top left]
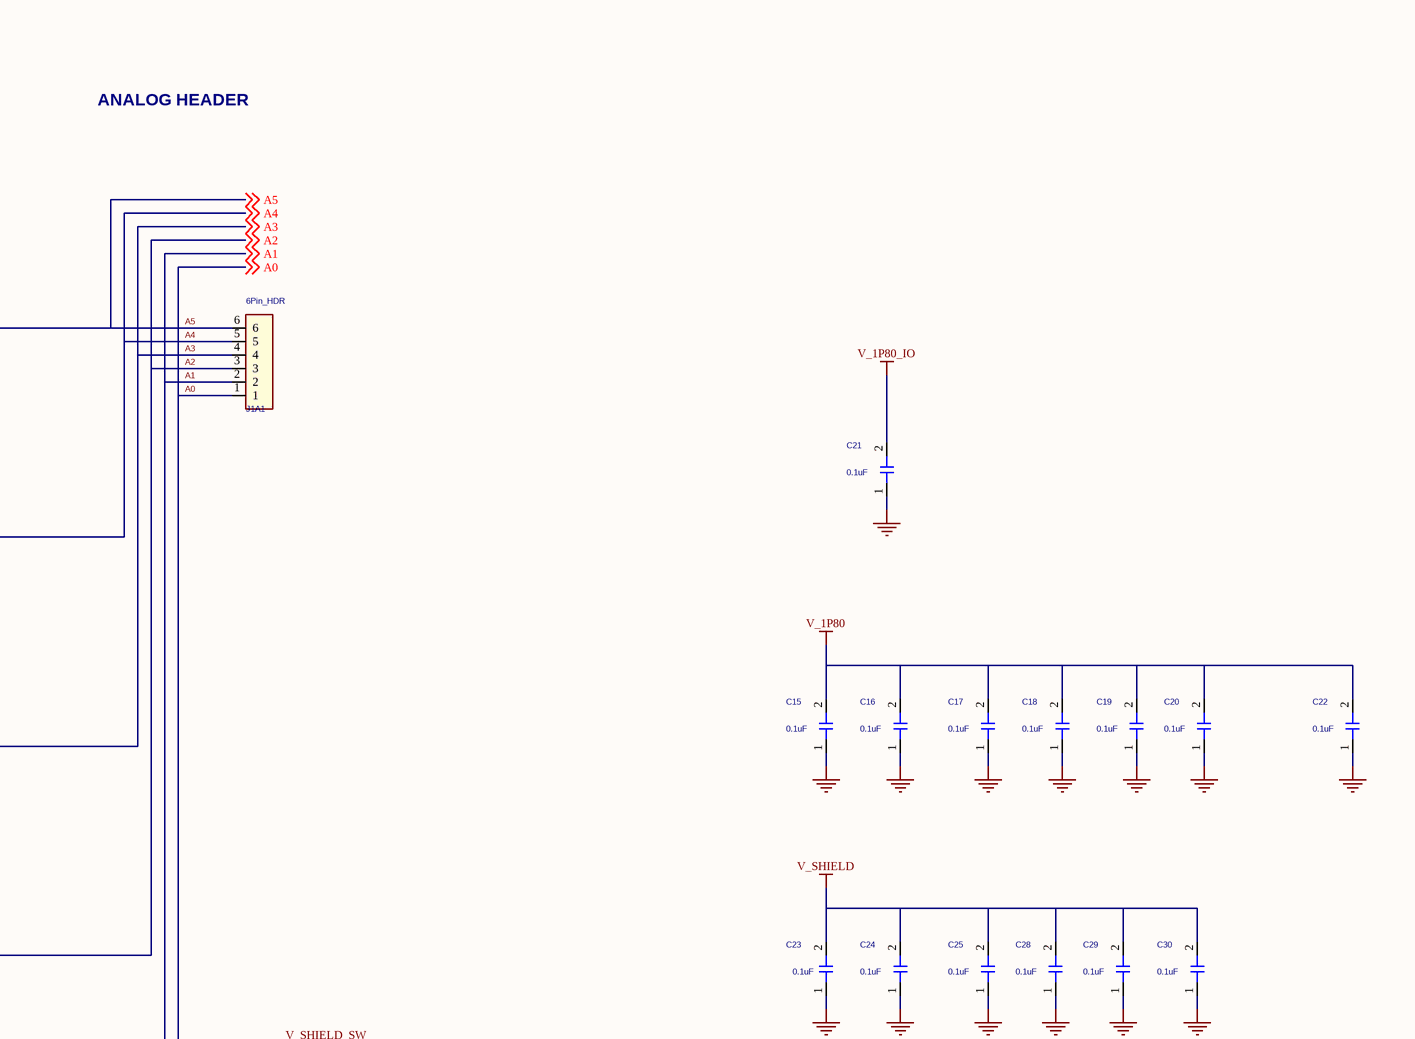
[diagram p9: 06) ANALOG TRANSLATION.SchDoc, top right]
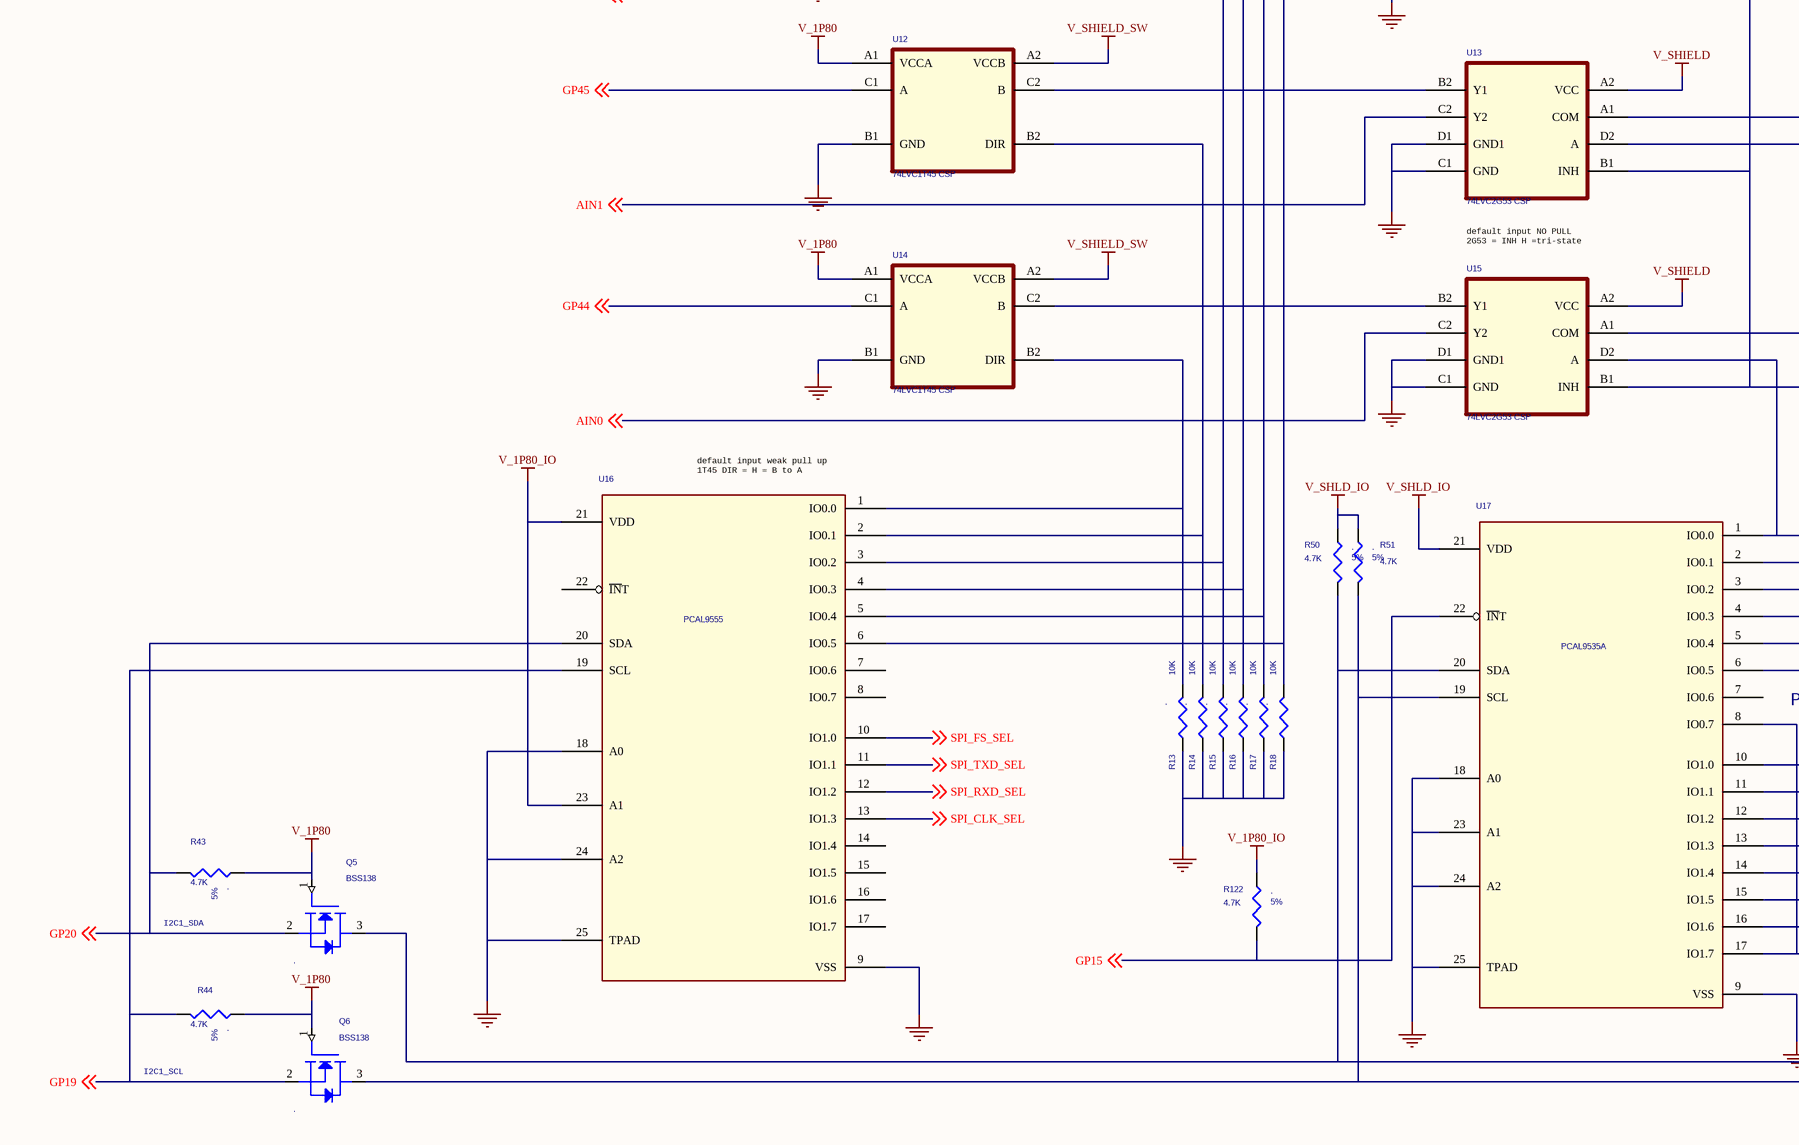
[diagram p10: 06) ANALOG TRANSLATION.SchDoc, bottom left]
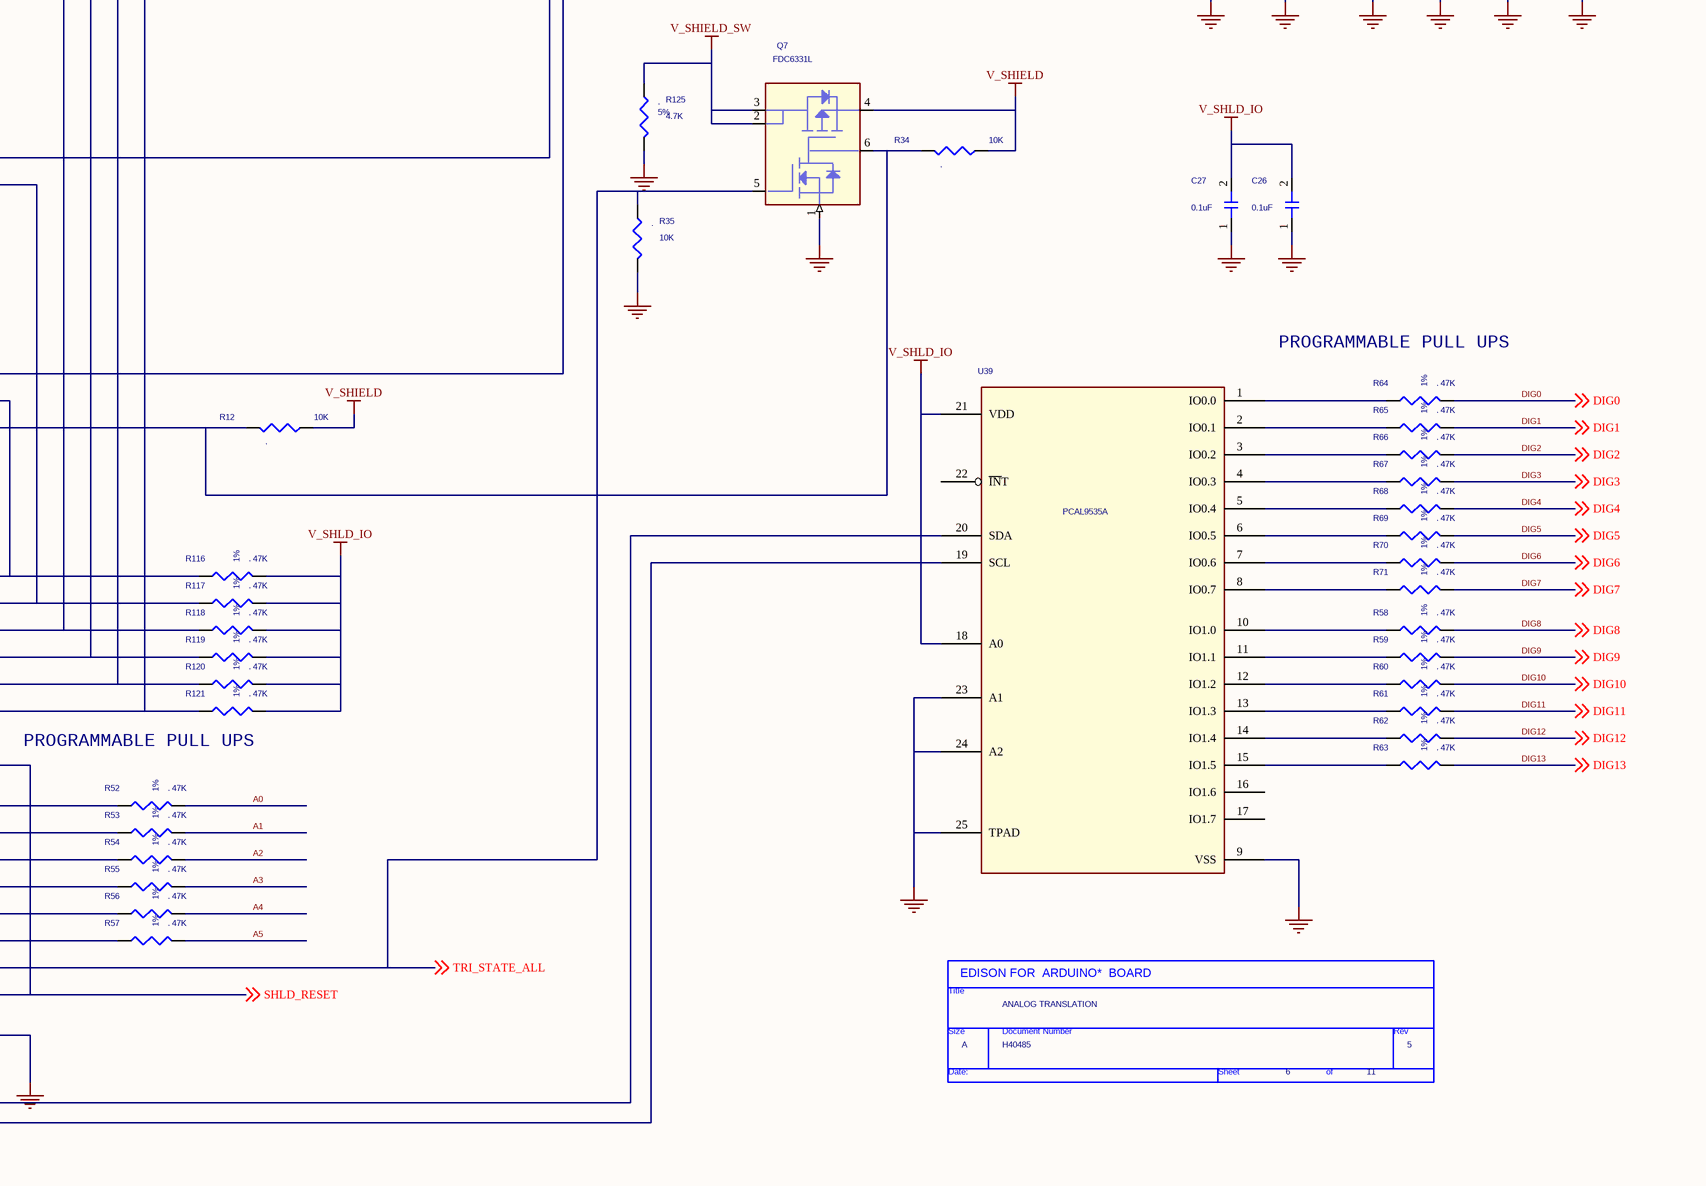
[diagram p11: 06) ANALOG TRANSLATION.SchDoc, bottom right]

### Parts
(Parts that share a designator on the sheet are numbered #1, #2 ... from top to bottom, then left to right.)
*#6  Page Count: 11  Page Number: 6  Page Size: A  Title: ANALOG TRANSLATION  RevCode: 5  Doc: H40485  (hidden comment: TitleBlock0)  (graphical)
C15  0.1uF  [C0201]
C16  0.1uF  [C0201]
C17  0.1uF  [C0201]
C18  0.1uF  [C0201]
C19  0.1uF  [C0201]
C20  0.1uF  [C0201]
C21  0.1uF  [C0201]
C22  0.1uF  [C0201]
C23  0.1uF  [C0201]
C24  0.1uF  [C0201]
C25  0.1uF  [C0201]
C26  0.1uF  [C0201]
C27  0.1uF  [C0201]
C28  0.1uF  [C0201]
C29  0.1uF  [C0201]
C30  0.1uF  [C0201]
J1A1  6Pin_HDR  [109728-038]
Q3  BSS138  NO_STUFF: .  [SOT23]
Q4  BSS138  NO_STUFF: .  [SOT23]
Q5  BSS138  NO_STUFF: .  [SOT23]
Q6  BSS138  NO_STUFF: .  [SOT23]
Q7  FDC6331L  [SSOT-6]
R12  10K  NO_STUFF: .  [SMR0201]
R13  10K  NO_STUFF: .  [SMR0201]
R14  10K  NO_STUFF: .  [SMR0201]
R15  10K  NO_STUFF: .  [SMR0201]
R16  10K  NO_STUFF: .  [SMR0201]
R17  10K  NO_STUFF: .  [SMR0201]
R18  10K  NO_STUFF: .  [SMR0201]
R34  10K  NO_STUFF: .  [SMR0201]
R35  10K  NO_STUFF: .  [SMR0201]
R39  4.7K  NO_STUFF: .  TOL: 5%  [SMR0201]
R40  4.7K  NO_STUFF: .  TOL: 5%  [SMR0201]
R41  4.7K  NO_STUFF: .  TOL: 5%  [SMR0201]
R42  4.7K  NO_STUFF: .  TOL: 5%  [SMR0201]
R43  4.7K  NO_STUFF: .  TOL: 5%  [SMR0201]
R44  4.7K  NO_STUFF: .  TOL: 5%  [SMR0201]
R50  4.7K  NO_STUFF: .  TOL: 5%  [SMR0201]
R51  4.7K  NO_STUFF: .  TOL: 5%  [SMR0201]
R52  47K  TOL: 1%  NO_STUFF: .  [SMR0201]
R53  47K  TOL: 1%  NO_STUFF: .  [SMR0201]
R54  47K  TOL: 1%  NO_STUFF: .  [SMR0201]
R55  47K  TOL: 1%  NO_STUFF: .  [SMR0201]
R56  47K  TOL: 1%  NO_STUFF: .  [SMR0201]
R57  47K  TOL: 1%  NO_STUFF: .  [SMR0201]
R58  47K  TOL: 1%  NO_STUFF: .  [SMR0201]
R59  47K  TOL: 1%  NO_STUFF: .  [SMR0201]
R60  47K  TOL: 1%  NO_STUFF: .  [SMR0201]
R61  47K  TOL: 1%  NO_STUFF: .  [SMR0201]
R62  47K  TOL: 1%  NO_STUFF: .  [SMR0201]
R63  47K  TOL: 1%  NO_STUFF: .  [SMR0201]
R64  47K  TOL: 1%  NO_STUFF: .  [SMR0201]
R65  47K  TOL: 1%  NO_STUFF: .  [SMR0201]
R66  47K  TOL: 1%  NO_STUFF: .  [SMR0201]
R67  47K  TOL: 1%  NO_STUFF: .  [SMR0201]
R68  47K  TOL: 1%  NO_STUFF: .  [SMR0201]
R69  47K  TOL: 1%  NO_STUFF: .  [SMR0201]
R70  47K  TOL: 1%  NO_STUFF: .  [SMR0201]
R71  47K  TOL: 1%  NO_STUFF: .  [SMR0201]
R116  47K  TOL: 1%  NO_STUFF: .  [SMR0201]
R117  47K  TOL: 1%  NO_STUFF: .  [SMR0201]
R118  47K  TOL: 1%  NO_STUFF: .  [SMR0201]
R119  47K  TOL: 1%  NO_STUFF: .  [SMR0201]
R120  47K  TOL: 1%  NO_STUFF: .  [SMR0201]
R121  47K  TOL: 1%  NO_STUFF: .  [SMR0201]
R122  4.7K  NO_STUFF: .  TOL: 5%  [SMR0201]
R125  4.7K  NO_STUFF: .  TOL: 5%  [SMR0201]
U4  74LVC1T45 CSP  [bga6_5mm_37x57]
U5  74LVC2G53 CSP  [bga8_2X4_P5MM]
U6  74LVC1T45 CSP  [bga6_5mm_37x57]
U7  74LVC2G53 CSP  [bga8_2X4_P5MM]
U8  74LVC1T45 CSP  [bga6_5mm_37x57]
U9  74LVC2G53 CSP  [bga8_2X4_P5MM]
U10  74LVC1T45 CSP  [bga6_5mm_37x57]
U11  74LVC2G53 CSP  [bga8_2X4_P5MM]
U12  74LVC1T45 CSP  [bga6_5mm_37x57]
U13  74LVC2G53 CSP  [bga8_2X4_P5MM]
U14  74LVC1T45 CSP  [bga6_5mm_37x57]
U15  74LVC2G53 CSP  [bga8_2X4_P5MM]
U16  PCAL9555  [LCC25_S41_5DF89X89MA]
U17  PCAL9535A  [LCC25_S41_5DF89X89MA]
U39  PCAL9535A  [LCC25_S41_5DF89X89MA]

### Nets
GND: C15.1(END1) C16.1(END1) C17.1(END1) C18.1(END1) C19.1(END1) C20.1(END1) C21.1(END1) C22.1(END1) C23.1(END1) C24.1(END1) C25.1(END1) C26.1(END1) C27.1(END1) C28.1(END1) C29.1(END1) C30.1(END1) Q7.1(R2) R13.1 R14.1 R15.1 R16.1 R17.1 R18.1 R35.1 R125.1 U4.B1(GND) U5.C1(GND) U5.D1(GND1) U6.B1(GND) U7.C1(GND) U7.D1(GND1) U8.B1(GND) U9.C1(GND) U9.D1(GND1) U10.B1(GND) U11.C1(GND) U11.D1(GND1) U12.B1(GND) U13.C1(GND) U13.D1(GND1) U14.B1(GND) U15.C1(GND) U15.D1(GND1) U16.9(VSS) U16.18(A0) U16.24(A2) U16.25(TPAD) U17.9(VSS) U17.18(A0) U17.23(A1) U17.24(A2) U17.25(TPAD) U39.9(VSS) U39.23(A1) U39.24(A2) U39.25(TPAD)  [project net PWRBTN_GND]
V_1P80: C15.2(END2) C16.2(END2) C17.2(END2) C18.2(END2) C19.2(END2) C20.2(END2) C22.2(END2) Q3.1(G) Q4.1(G) Q5.1(G) Q6.1(G) R39.2 R40.2 R43.2 R44.2 U4.A1(VCCA) U6.A1(VCCA) U8.A1(VCCA) U10.A1(VCCA) U12.A1(VCCA) U14.A1(VCCA)
V_1P80_IO: C21.2(END2) R122.2 U16.21(VDD) U16.23(A1)
V_SHIELD: C23.2(END2) C24.2(END2) C25.2(END2) C28.2(END2) C29.2(END2) C30.2(END2) Q7.4(VOUT) R12.1 R34.1 R41.2 R42.2 U5.A2(VCC) U7.A2(VCC) U9.A2(VCC) U11.A2(VCC) U13.A2(VCC) U15.A2(VCC)
V_SHIELD_SW: Q7.2(VOUT2) Q7.3(VOUT1) R125.2 U4.A2(VCCB) U6.A2(VCCB) U8.A2(VCCB) U10.A2(VCCB) U12.A2(VCCB) U14.A2(VCCB)
V_SHLD_IO: C26.2(END2) C27.2(END2) R50.2 R51.2 R116.2 R117.2 R118.2 R119.2 R120.2 R121.2 U17.21(VDD) U39.18(A0) U39.21(VDD)
A0: J1A1.1 R52.2 U15.A1(COM) ; off-sheet A0
A1: J1A1.2 R53.2 U13.A1(COM) ; off-sheet A1
A2: J1A1.3 R54.2 U11.A1(COM) ; off-sheet A2
A3: J1A1.4 R55.2 U9.A1(COM) ; off-sheet A3
A4: J1A1.5 R56.2 U7.A1(COM) ; off-sheet A4
A5: J1A1.6 R57.2 U5.A1(COM) ; off-sheet A5
AIN0: U15.C2(Y2) ; off-sheet AIN0
AIN1: U13.C2(Y2) ; off-sheet AIN1
AIN2: U11.C2(Y2) ; off-sheet AIN2
AIN3: U9.C2(Y2) ; off-sheet AIN3
AIN4: U7.C2(Y2) ; off-sheet AIN4
AIN5: U5.C2(Y2) ; off-sheet AIN5
DIG0: R64.2 ; off-sheet DIG0
DIG1: R65.2 ; off-sheet DIG1
DIG2: R66.2 ; off-sheet DIG2
DIG3: R67.2 ; off-sheet DIG3
DIG4: R68.2 ; off-sheet DIG4
DIG5: R69.2 ; off-sheet DIG5
DIG6: R70.2 ; off-sheet DIG6
DIG7: R71.2 ; off-sheet DIG7
DIG8: R58.2 ; off-sheet DIG8
DIG9: R59.2 ; off-sheet DIG9
DIG10: R60.2 ; off-sheet DIG10
DIG11: R61.2 ; off-sheet DIG11
DIG12: R62.2 ; off-sheet DIG12
DIG13: R63.2 ; off-sheet DIG13
GP14: U6.C1(A) ; off-sheet GP14
GP15: R122.1 U17.22(~{IN}T) ; off-sheet GP15
GP19: Q6.2(S) R44.1 U16.19(SCL) ; off-sheet GP19
GP20: Q5.2(S) R43.1 U16.20(SDA) ; off-sheet GP20
GP27: Q3.2(S) R39.1 ; off-sheet GP27
GP28: Q4.2(S) R40.1 ; off-sheet GP28
GP44: U14.C1(A) ; off-sheet GP44
GP45: U12.C1(A) ; off-sheet GP45
GP46: U10.C1(A) ; off-sheet GP46
GP47: U8.C1(A) ; off-sheet GP47
GP165: U4.C1(A) ; off-sheet GP165
SHLD_RESET: U17.8(IO0.7) U17.17(IO1.7) ; off-sheet SHLD_RESET
SPI_CLK_SEL: U16.13(IO1.3) ; off-sheet SPI_CLK_SEL
SPI_FS_SEL: U16.10(IO1.0) ; off-sheet SPI_FS_SEL
SPI_RXD_SEL: U16.12(IO1.2) ; off-sheet SPI_RXD_SEL
SPI_TXD_SEL: U16.11(IO1.1) ; off-sheet SPI_TXD_SEL
TRI_STATE_ALL: Q7.5(ON) R35.2 U17.16(IO1.6) ; off-sheet TRI_STATE_ALL
NetQ3_3: Q3.3(D) R41.1 U4.C2(B) U5.B2(Y1)
NetQ4_3: Q4.3(D) R42.1 U6.C2(B) U7.B2(Y1)
NetQ5_3: Q5.3(D) R50.1 U17.20(SDA) U39.20(SDA)
NetQ6_3: Q6.3(D) R51.1 U17.19(SCL) U39.19(SCL)
NetQ7_6: Q7.6(R1C1) R12.2 R34.2 U5.B1(INH) U7.B1(INH) U9.B1(INH) U11.B1(INH) U13.B1(INH) U15.B1(INH)
NetR13_2: R13.2 U14.B2(DIR) U16.1(IO0.0)
NetR14_2: R14.2 U12.B2(DIR) U16.2(IO0.1)
NetR15_2: R15.2 U10.B2(DIR) U16.3(IO0.2)
NetR16_2: R16.2 U8.B2(DIR) U16.4(IO0.3)
NetR17_2: R17.2 U6.B2(DIR) U16.5(IO0.4)
NetR18_2: R18.2 U4.B2(DIR) U16.6(IO0.5)
NetR52_1: R52.1 U17.10(IO1.0)
NetR53_1: R53.1 U17.11(IO1.1)
NetR54_1: R54.1 U17.12(IO1.2)
NetR55_1: R55.1 U17.13(IO1.3)
NetR56_1: R56.1 U17.14(IO1.4)
NetR57_1: R57.1 U17.15(IO1.5)
NetR58_1: R58.1 U39.10(IO1.0)
NetR59_1: R59.1 U39.11(IO1.1)
NetR60_1: R60.1 U39.12(IO1.2)
NetR61_1: R61.1 U39.13(IO1.3)
NetR62_1: R62.1 U39.14(IO1.4)
NetR63_1: R63.1 U39.15(IO1.5)
NetR64_1: R64.1 U39.1(IO0.0)
NetR65_1: R65.1 U39.2(IO0.1)
NetR66_1: R66.1 U39.3(IO0.2)
NetR67_1: R67.1 U39.4(IO0.3)
NetR68_1: R68.1 U39.5(IO0.4)
NetR69_1: R69.1 U39.6(IO0.5)
NetR70_1: R70.1 U39.7(IO0.6)
NetR71_1: R71.1 U39.8(IO0.7)
NetR116_1: R116.1 U15.D2(A) U17.1(IO0.0)
NetR117_1: R117.1 U13.D2(A) U17.2(IO0.1)
NetR118_1: R118.1 U11.D2(A) U17.3(IO0.2)
NetR119_1: R119.1 U9.D2(A) U17.4(IO0.3)
NetR120_1: R120.1 U7.D2(A) U17.5(IO0.4)
NetR121_1: R121.1 U5.D2(A) U17.6(IO0.5)
NetU8_C2: U8.C2(B) U9.B2(Y1)
NetU10_C2: U10.C2(B) U11.B2(Y1)
NetU12_C2: U12.C2(B) U13.B2(Y1)
NetU14_C2: U14.C2(B) U15.B2(Y1)

Not connected (* = marked no-connect by the designer): U16 7(IO0.6) 8(IO0.7) 14(IO1.4) 15(IO1.5) 16(IO1.6) 17(IO1.7) 22(~{IN}T); U17 7(IO0.6); U39 16(IO1.6) 17(IO1.7) 22(~{IN}T)

### Notes on the sheet
- I2C6_SCL
- I2C6_SDA
- ANALOG HEADER
- default input NO PULL
  2G53 = INH H =tri-state
- PROGRAMMABLE PULL UPS
- (near U16) default input weak pull up
  1T45 DIR = H = B to A
- (near R121) PROGRAMMABLE PULL UPS
- (near R43) I2C1_SDA
- I2C1_SCL
- (in symbol TitleBlock0) EDISON FOR  ARDUINO*  BOARD; Title; Size; Document Number; Rev; Date:; Sheet; of

### Library data of the parts
C15-C22 C24-C27 = CAP: as C49 on sheet 10) Button and I_O Conn; VOLTAGE: ?; PERC: ?; PATH: ?
C23 C28-C30 = CAP: as C32 on sheet 08) SD card; VOLTAGE: ?; PERC: ?; PATH: ?
J1A1 = CON6,HDR,TH,0.1in,C77962-001: CONN,PLUG,VERT,1X6,2.54MM,THM,90147_1106; NO_STUFF: .; RATING: 1Amax; DEVICE: H46111-001; LEAD_FREE: YES; BOM: x; ROOM: NO_ROOM; IPN: H46111-001; PART_NUMBER: H46111-001; FINANCE: x
Q3-Q6 = XSTR,BSS138,FET,NCH,SOT23: as Q8 on sheet 11) TEST POINTS; BOM: x; IPN: C81974-001; PART_NUMBER: C81974-001
Q7 = IC,FDC6331,LOADSWI: as Q12 on sheet 10) Button and I_O Conn; IPN: G79283-001; Device: fdc6331; FINANCE: x; PART NUMBER: G79283-001
R12-R18 R34 R35 = RESD,0201,5%,1/20W,10K: as R100 on sheet 10) Button and I_O Conn; RATING: 1/20W; IPN: C80792-002; PART_NUMBER: C80792-002; LEAD_FREE: YES; FINANCE: x
R39-R44 R50 R51 R122 R125 = RESD,0201,5%,1/20W,4.7K: as R108 on sheet 10) Button and I_O Conn; RATING: 1/20W; IPN: C80792-014; PART_NUMBER: C80792-014; LEAD_FREE: YES; FINANCE: x
R52-R71 R116-R121 = RESD,0201,1%,1/20W,47K: as R89 on sheet 07) DIGITAL TRANSLATION; BOM: x; IPN: C48657-118; RATING: 1/20W; Device: C48657-118
U4 U6 U8 U10 U12 U14 = IC,74LVC1T45,LOG,BGA6,TRNSSVR: as U18 on sheet 07) DIGITAL TRANSLATION; BOM: x; DEVICE: G42189-001; PART_NUMBER: G42189-001
U5 U7 U9 U11 U13 U15 = IC,74LVC2G53: as U22 on sheet 07) DIGITAL TRANSLATION; BOM: x; DEVICE: LVC2G53; MFG P/N: 74LVC2G53
U16 = IC,PCAL9555,16bit_GPIO: as U34 on sheet 07) DIGITAL TRANSLATION; IPN: H31921-001; Part_Number: H31921-001; FINANCE: x; PART NUMBER: H31921-001
U17 U39 = IC,PCAL9535a,16bit_GPIO: Part_Number: H47895-001; FINANCE: x; LEAD_FREE: YES; NO_STUFF: .; BOM: x; IPN: h47895-001; DEVICE: H47895-001
*#6 = TitleBlock0: Page Create Date: March  8, 1995

## Sheet 05) SPI ADC AND SWIZZLE.SchDoc
size 447 x 332 mm
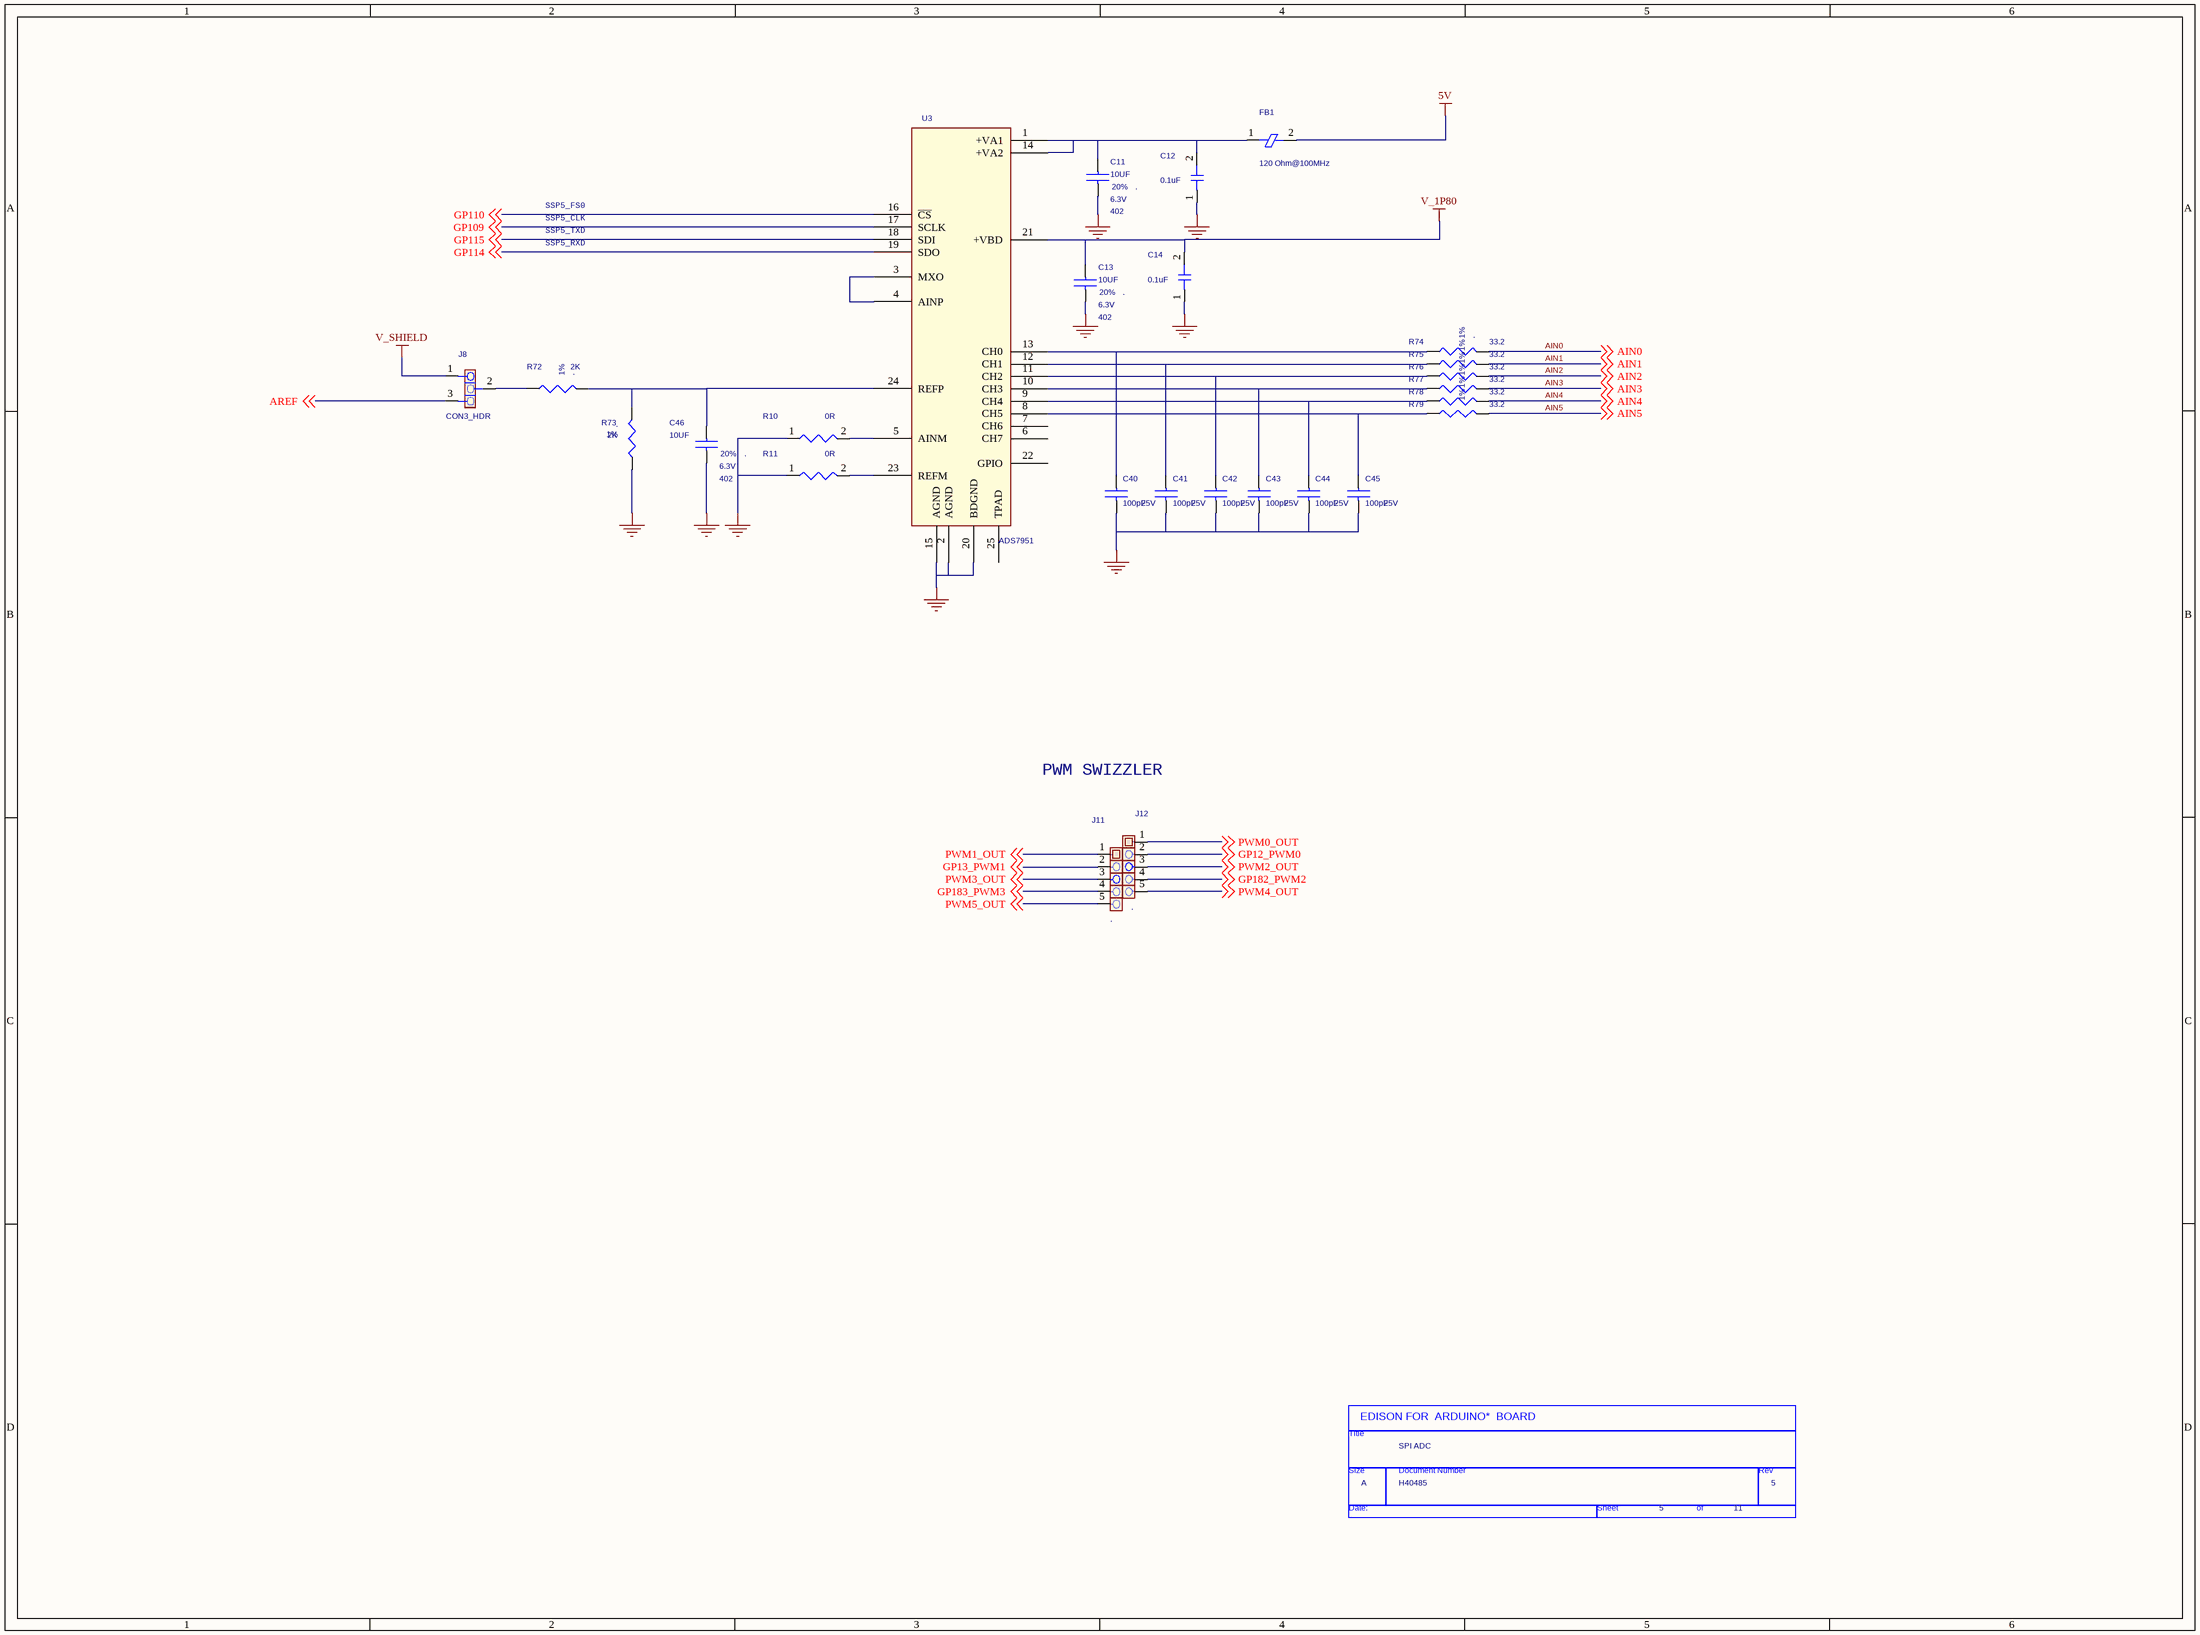
[diagram p12: 05) SPI ADC AND SWIZZLE.SchDoc]

### Parts
(Parts that share a designator on the sheet are numbered #1, #2 ... from top to bottom, then left to right.)
*#7  Page Count: 11  Page Number: 5  Page Size: A  Title: SPI ADC  Doc: H40485  (hidden comment: TitleBlock0)  (graphical)
C11  10UF  SIZE: 402  NO_STUFF: .  TOL: 20%  RATING: 6.3V  [SMC0402]
C12  0.1uF  [C0201]
C13  10UF  SIZE: 402  NO_STUFF: .  TOL: 20%  RATING: 6.3V  [SMC0402]
C14  0.1uF  [C0201]
C40  100pF  RATING: 25V  [SMC0201]
C41  100pF  RATING: 25V  [SMC0201]
C42  100pF  RATING: 25V  [SMC0201]
C43  100pF  RATING: 25V  [SMC0201]
C44  100pF  RATING: 25V  [SMC0201]
C45  100pF  RATING: 25V  [SMC0201]
C46  10UF  SIZE: 402  NO_STUFF: .  TOL: 20%  RATING: 6.3V  [SMC0402]
FB1  120 Ohm@100MHz  [SMF0402]
J8  CON3_HDR  [1x3hdr_p100in_th]
J11  NO_STUFF: .  [102276-005]  (hidden comment: 1X5_HDR)
J12  NO_STUFF: .  [102276-005]  (hidden comment: 1X5_HDR)
R10  0R  [0603.PRT]
R11  0R  [0603.PRT]
R72  2K  TOL: 1%  NO_STUFF: .  [SMR0201]
R73  2K  TOL: 1%  NO_STUFF: .  [SMR0201]
R74  33.2  NO_STUFF: .  TOL: 1%  [SMR0201]
R75  33.2  NO_STUFF: .  TOL: 1%  [SMR0201]
R76  33.2  NO_STUFF: .  TOL: 1%  [SMR0201]
R77  33.2  NO_STUFF: .  TOL: 1%  [SMR0201]
R78  33.2  NO_STUFF: .  TOL: 1%  [SMR0201]
R79  33.2  NO_STUFF: .  TOL: 1%  [SMR0201]
U3  ADS7951  [QFN24P_5M_4X4M]

### Nets
5V: FB1.2(FB2)
GND: C11.2 C12.1(END1) C13.2 C14.1(END1) C40.2 C41.2 C42.2 C43.2 C44.2 C45.2 C46.2 R10.1 R11.1 R73.1 U3.2(AGND) U3.15(AGND) U3.20(BDGND)  [project net PWRBTN_GND]
V_1P80: C13.1 C14.2(END2) U3.21(+VBD)
V_SHIELD: J8.1
AIN0: R74.2 ; off-sheet AIN0
AIN1: R75.2 ; off-sheet AIN1
AIN2: R76.2 ; off-sheet AIN2
AIN3: R77.2 ; off-sheet AIN3
AIN4: R78.2 ; off-sheet AIN4
AIN5: R79.2 ; off-sheet AIN5
AREF: J8.3 ; off-sheet AREF
GP12_PWM0: J12.2 ; off-sheet GP12_PWM0
GP13_PWM1: J11.2 ; off-sheet GP13_PWM1
GP109: U3.17(SCLK) ; off-sheet GP109
GP110: U3.16(~{CS}) ; off-sheet GP110
GP114: U3.19(SDO) ; off-sheet GP114
GP115: U3.18(SDI) ; off-sheet GP115
GP182_PWM2: J12.4 ; off-sheet GP182_PWM2
GP183_PWM3: J11.4 ; off-sheet GP183_PWM3
PWM0_OUT: J12.1 ; off-sheet PWM0_OUT
PWM1_OUT: J11.1 ; off-sheet PWM1_OUT
PWM2_OUT: J12.3 ; off-sheet PWM2_OUT
PWM3_OUT: J11.3 ; off-sheet PWM3_OUT
PWM4_OUT: J12.5 ; off-sheet PWM4_OUT
PWM5_OUT: J11.5 ; off-sheet PWM5_OUT
NetC11_1: C11.1 C12.2(END2) FB1.1(FB1) U3.1(+VA1) U3.14(+VA2)
NetC40_1: C40.1 R74.1 U3.13(CH0)
NetC41_1: C41.1 R75.1 U3.12(CH1)
NetC42_1: C42.1 R76.1 U3.11(CH2)
NetC43_1: C43.1 R77.1 U3.10(CH3)
NetC44_1: C44.1 R78.1 U3.9(CH4)
NetC45_1: C45.1 R79.1 U3.8(CH5)
NetC46_1: C46.1 R72.2 R73.2 U3.24(REFP)
NetJ8_2: J8.2 R72.1
NetR10_2: R10.2 U3.5(AINM)
NetR11_2: R11.2 U3.23(REFM)
NetU3_3: U3.3(MXO) U3.4(AINP)

Not connected (* = marked no-connect by the designer): U3 6(CH7) 7(CH6) 22(GPIO) 25(TPAD)

### Notes on the sheet
- SSP5_FS0
- SSP5_CLK
- SSP5_TXD
- SSP5_RXD
- PWM SWIZZLER
- (in symbol TitleBlock0) EDISON FOR  ARDUINO*  BOARD; Title; Size; Document Number; Rev; Date:; Sheet; of

### Library data of the parts
C11 C13 C46 = CAPC,X5R,0402,6.3V,20%,10uF: CAP C,10UF,0402,X5R,6.3V,+/-20%,; PART_NUMBER: A36096-114; Device: G21049-001; LEAD_FREE: YES; BOM: x; IPN: G21049-001; FINANCE: x
C12 C14 = CAP: as C32 on sheet 08) SD card; VOLTAGE: ?; PERC: ?; PATH: ?
C40-C45 = CAPC,COG,0201,25V,5%,100pF: as C34 on sheet 07) DIGITAL TRANSLATION; IPN: D70542-001; Device: D70542-001; FINANCE: x
FB1 = FERBD,0402,120Ohm_100MHz,1.3A: FER-BEAD,0402,120.0 OHM,1.3 A,± 25%; PART_NUMBER: A51464-017; FINANCE: x; LEAD_FREE: YES; ROOM: AUDIO_SPKR; NO_STUFF: .; BOM: x; IPN: A51464-017; Device: A51464-017
J8 = CON3,HDR,TH,0.1in,A91829-009: CONN,HDR,1 X 3,PLG,VT,0.1,062ST,KP; IPN: A91829-001; LEAD_FREE: YES; NO_STUFF: .; Device: A91829-001; BOM: x; FINANCE: x; PART_NUMBER: A91829-001
J11 J12 = CON5,HDR,TH,100mil,A91829-006: CONN,HDR,1 X 5,PLG,VT,0.1,093ST,KP 0.23>; PART_NUMBER: C88650-001; LEAD_FREE: YES; FINANCE: x; BOM: x; IPN: C88650-001; Device: C88650-001
R10 R11 = R_0: RES_D,0201,0.00OHM,1/20W; PART_NUMBER: C80792-009; Manufacturer: Yageo
R72 R73 = RESD,0201,1%,1/20W,2K: RES D,0201,2.00 kOHM,1.00%,1/20W,YES; PART_NUMBER: C48657-013; FINANCE: x; ROOM: APE_PMIC_MISC; BOM: x; LEAD_FREE: YES; IPN: C48657-013; RATING: 1/20W; Device: C48657-013
R74-R79 = RESD,0201,1%,1/20W,33.2: RES D,0201,33.2OHM,1.00%,1/20W,YES; Device: C48657-043; BOM: x; RATING: 1/20W; IPN: C48657-043; PART_NUMBER: C48657-043; LEAD_FREE: YES; FINANCE: x
U3 = ads7959_0: IC, LIN,VFQFPN,ADS7828E,ADC; PART_NUMBER: H40908-001; MFG PN: ADS7955SRGET
*#7 = TitleBlock0: RevCode: 5; Page Create Date: March  8, 1995